# EAGLE board dsp_ice_rev2_release (EAGLE 7.6.0), part 1 of 2
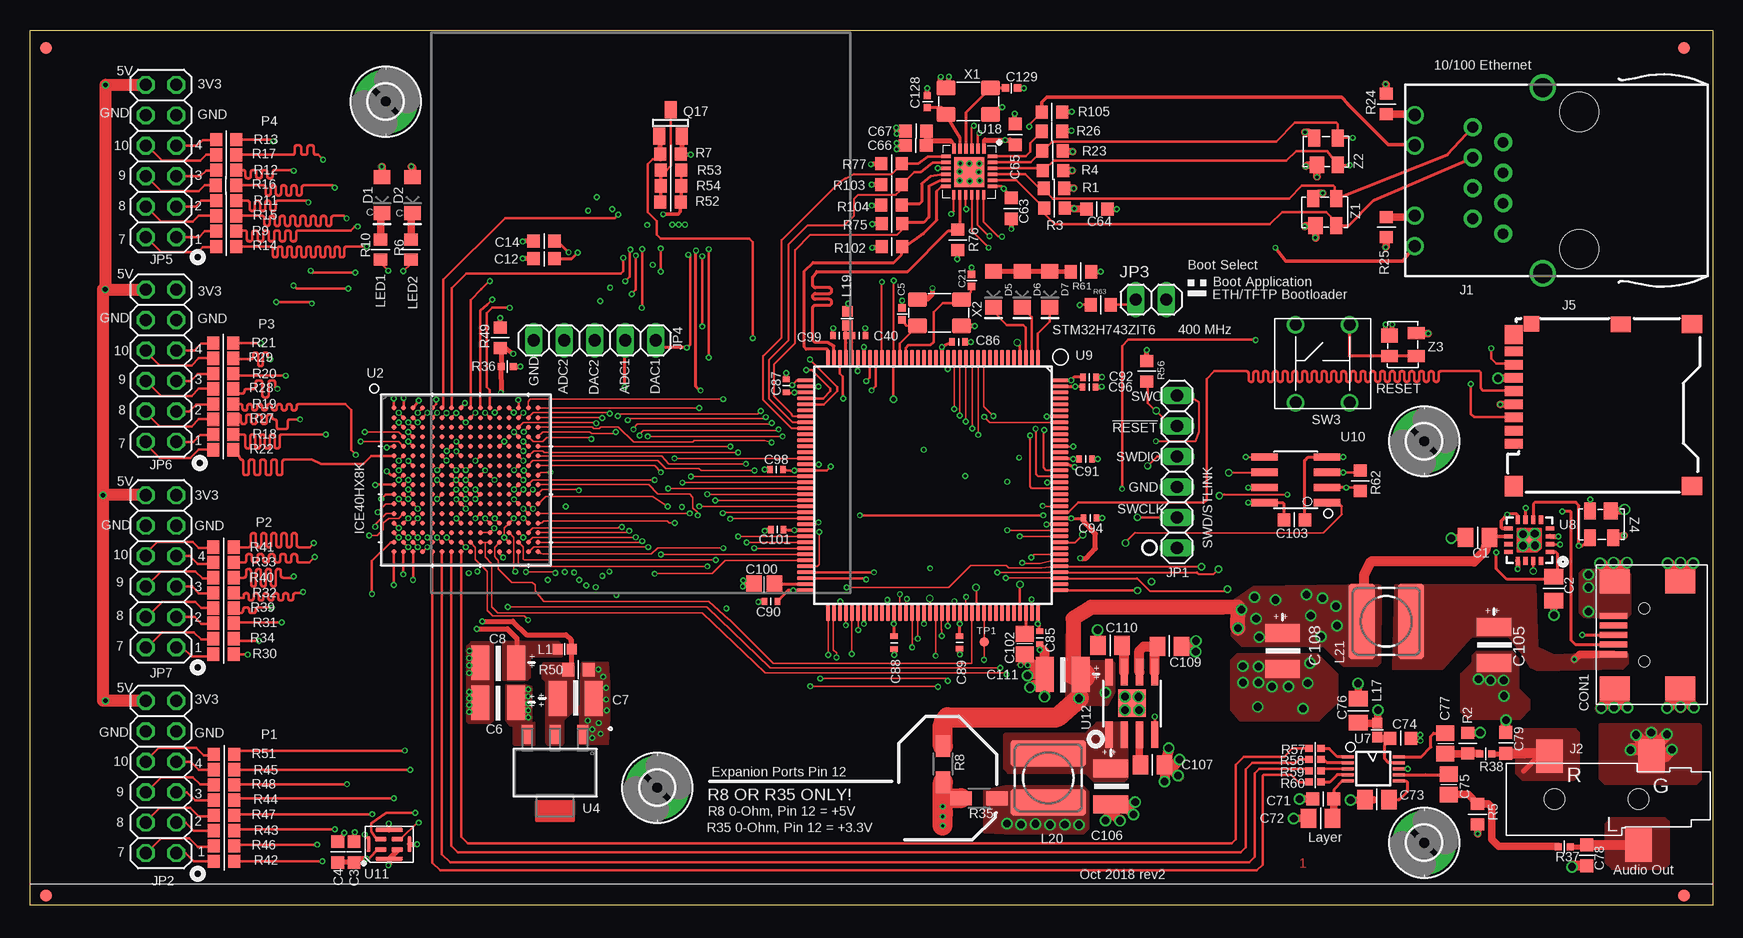
[diagram p8: board, top side]
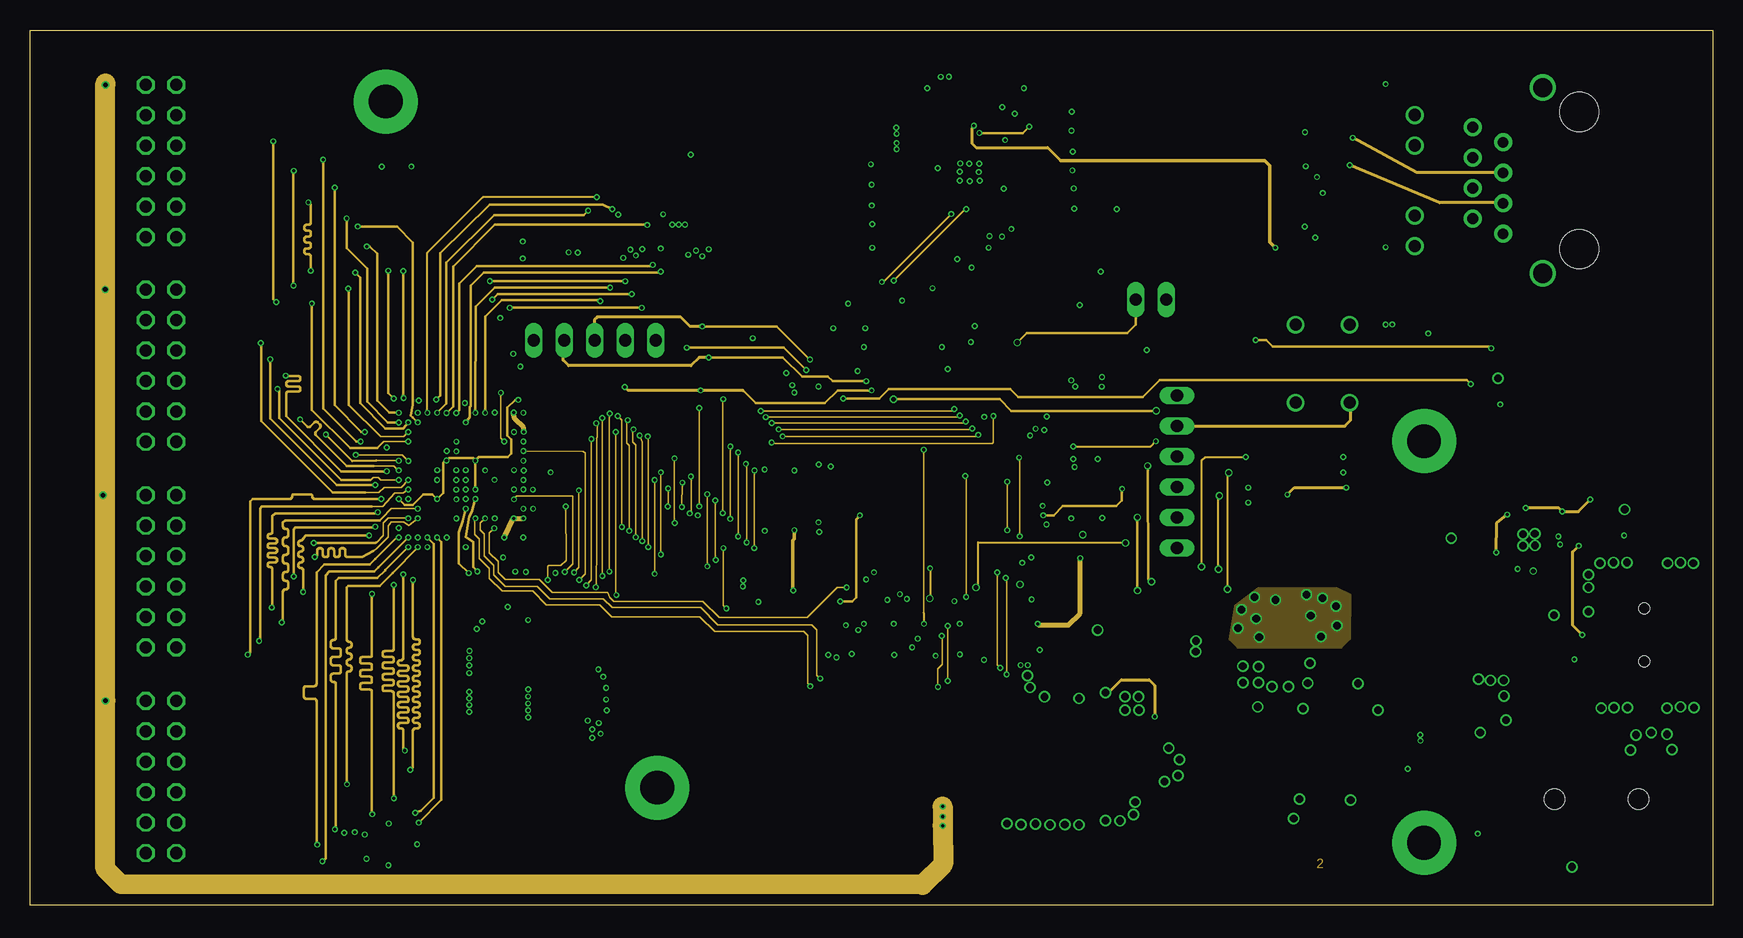
[diagram p9: board, inner layer Route2]
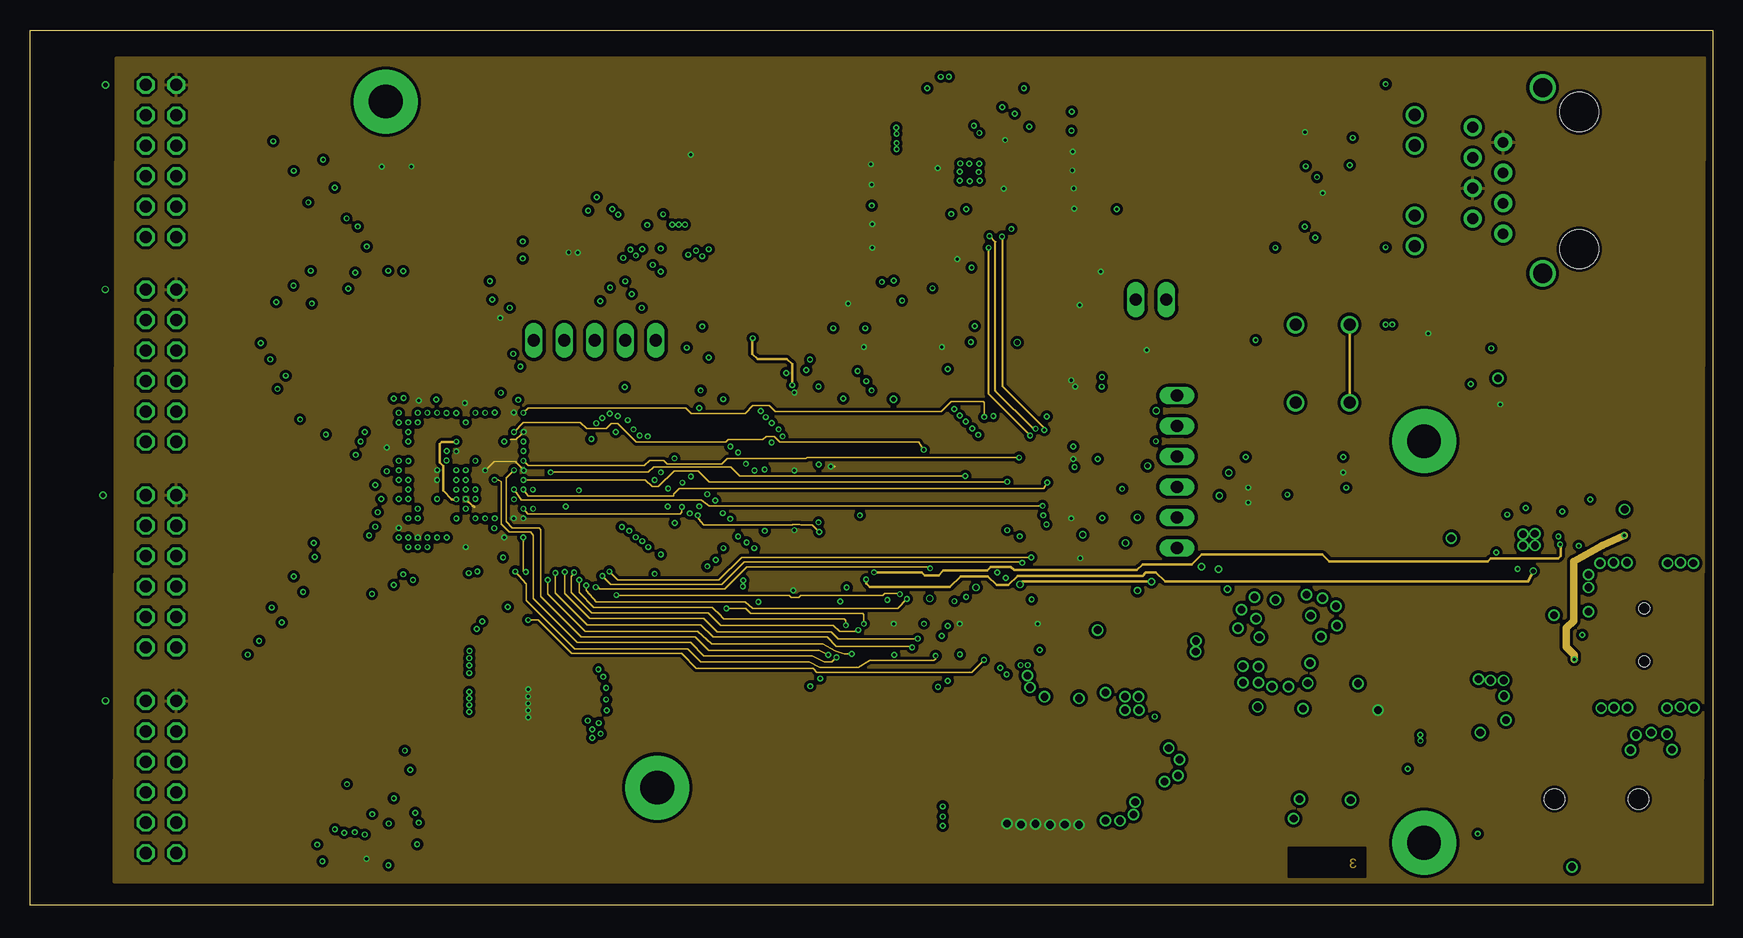
[diagram p10: board, inner layer Route3]
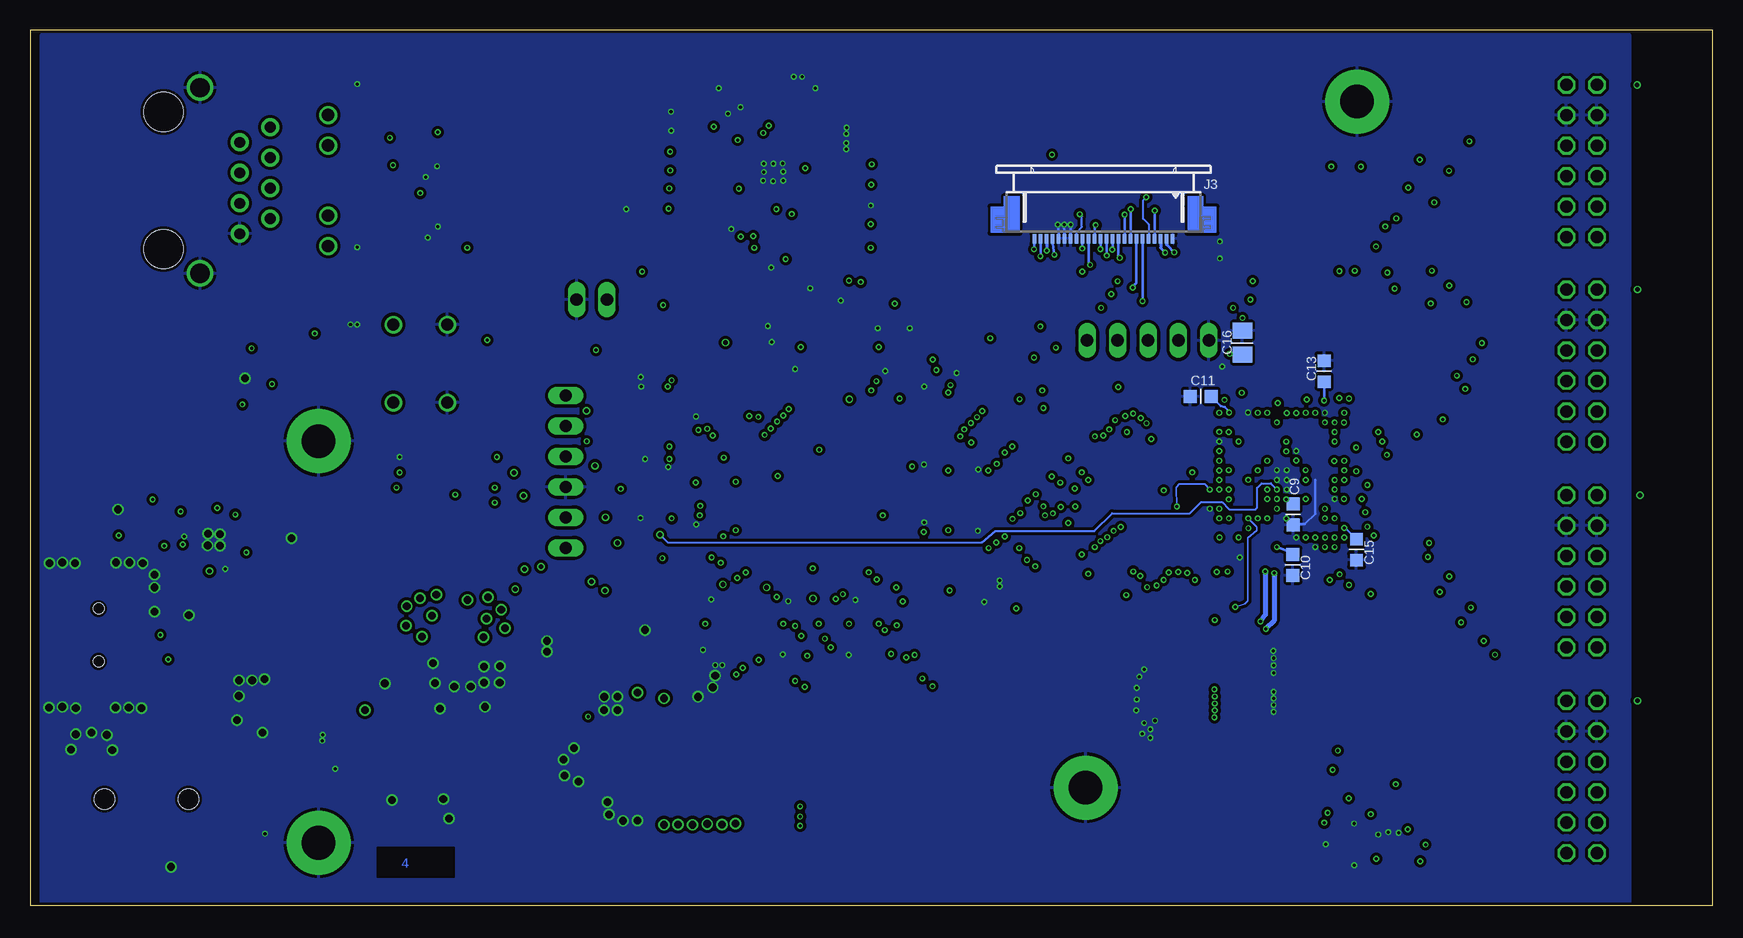
[diagram p11: board, bottom side, seen from below]

Size 140.23 x 73 mm. Coordinates in mm from the lower left corner, seen from the top.
Outline: 0,73 140.23,73 140.23,0 0,0 0,73
Copper layers (1+2+3+16): Top 0.035mm / dielectric 0.2mm / Route2 0.035mm / dielectric 0.15mm / Route3 0.035mm / dielectric 0.2mm / Bottom 0.035mm
Design rules "default *": minimum track width 5mil, minimum drill 10mil, track to track 5mil, track to pad 5mil, pad to pad 5mil, via to via 5mil, smd to smd 1mil, copper to edge 10mil, drill to drill 10mil, minimum pad ring 4.5mil, minimum via ring 4.5mil, stop-mask expansion 0mil, vias tented up to drill 25mil, thermal gap 10mil

## Footprints (pad centres in the part's own frame; a part is rotated, then mirrored left to right if it is on the bottom)
C0805 = smd 1.3 x 1.6: 1 -1,0; 2 1,0
C0603 = smd 1.05 x 1.08: 1 -0.875,0; 2 0.875,0
C0402 = smd 0.6 x 0.6: 1 -0.5,0; 2 0.501,0
1210K = smd 1.5 x 2.9: A -1.5,0; C 1.5,0
0402 = smd 0.457 x 0.61: 1 -0.524,0; 2 0.549,0
C0805' = smd 1.3 x 1.5: 1 -0.85,0; 2 0.85,0
1734035-2 = smd 2.3 x 0.5: 1 2.9,1.45; 2 2.9,0.65; 3 2.9,-0.15; 4 2.9,-0.95; 5 2.9,-1.75 | smd 2.5 x 2: 6 -2.65,-4.6; 7 -2.65,4.3; 8 2.8,-4.6; 9 2.8,4.3 | hole 0.9: 0.35,2.05; 0.35,-2.35
LED-1206 = smd 1.2 x 1.4: A -1.5,0; C 1.5,0
FIDUCIAL = smd 1.016 x 1.016: 1 0,0
2,8-PAD = drill 2.8 pad 5.334: B2,8 0,0
SI-50170 = drill 0.9 pad 1.5: 1 4.445,5.842; 2 3.175,3.302; 3 1.905,5.842; 4 0.635,3.302; 5 -0.635,5.842; 6 -1.905,3.302; 7 -3.175,5.842; 8 -4.445,3.302 | drill 1.016 pad 1.5: A1 -5.461,10.668; A2 2.921,10.668; C1 -2.921,10.668; C2 5.461,10.668 | drill 1.6 pad 2.2: S1 -7.747,0; S2 7.747,0 | hole 3.251: -5.715,-3.048; 5.715,-3.048
SJ-3523 = smd 2.2 x 2.8: G 8.1,3.6; L 7,-3.8; R -0.4,3.6 | hole 1.7: 0,0; 7,0
52745-2490 = smd 0.3 x 0.8: 1 -5.75,2.5; 2 -5.25,2.5; 3 -4.75,2.5; 4 -4.25,2.5; 5 -3.75,2.5; 6 -3.25,2.5; 7 -2.75,2.5; 8 -2.25,2.5; 9 -1.75,2.5; 10 -1.25,2.5; 11 -0.75,2.5; 12 -0.25,2.5; 13 0.25,2.5; 14 0.75,2.5; 15 1.25,2.5; 16 1.75,2.5; 17 2.25,2.5; 18 2.75,2.5; 19 3.25,2.5; 20 3.75,2.5; 21 4.25,2.5; 22 4.75,2.5; 23 5.25,2.5; 24 5.75,2.5
SD-502774-001 = smd 0.8 x 1.5: 1 3.26,-7.43; 2 2.16,-7.43; 3 1.06,-7.43; 4 -0.04,-7.43; 5 -1.14,-7.43; 6 -2.24,-7.43; 7 -3.34,-7.43; 8 -4.44,-7.43 | smd 1.29 x 1.7: DET -6.69,1.5 | smd 1.7 x 1.5: GND@1 6.8,-7.4 | smd 1.5 x 1.7: GND@2 6.78,7.44; GND@3 -6.72,7.45 | smd 1.6 x 1.5: GND@4 -5.85,-7.42 | smd 1.29 x 1.3: SW -6.76,-5.94
1X06 = drill 1.016 long: 1 -6.35,0; 2 -3.81,0; 3 -1.27,0; 4 1.27,0; 5 3.81,0; 6 6.35,0
2X06 = drill 1.016 octagon: 1 -6.35,-1.27; 2 -3.81,-1.27; 3 -1.27,-1.27; 4 1.27,-1.27; 5 3.81,-1.27; 6 6.35,-1.27; 7 -6.35,1.27; 8 -3.81,1.27; 9 -1.27,1.27; 10 1.27,1.27; 11 3.81,1.27; 12 6.35,1.27
1X02 = drill 1.016 long: 1 -1.27,0; 2 1.27,0
1X05 = drill 1.016 long: 1 -5.08,0; 2 -2.54,0; 3 0,0; 4 2.54,0; 5 5.08,0
0603 = smd 0.864 x 0.864: 1 -0.595,0; 2 0.573,0
POWER-CHOKE_WE-TPC = smd 6.3 x 2.2: 1 0,2.05; 2 0,-2.05
SOT23_BSS84_PACKAGE = smd 1 x 1.4: 1 -0.942,-1.116; 2 0.941,-1.116; 3 0,1.092
R0603 = smd 1 x 1.1: 1 -0.85,0; 2 0.85,0
R1206W = smd 1.8 x 1.2: 1 -1.499,0; 2 1.499,0
R0402 = smd 0.6 x 0.6: 1 -0.5,0; 2 0.5,0
TACTILE_6X6MM = drill 1: 1 0,0; 2 4.5,0; 3 4.5,6.5; 4 0,6.5
TP08R = smd 0.8 x 0.8: TP 0,0
CABGA256 = smd 0.406 x 0.406: A1 -6,6; A2 -5.2,6; A3 -4.4,6; A4 -3.6,6; A5 -2.8,6; A6 -2,6; A7 -1.2,6; A8 -0.4,6; A9 0.4,6; A10 1.2,6; A11 2,6; A12 2.8,6; A13 3.6,6; A14 4.4,6; A15 5.2,6; A16 6,6; B1 -6,5.2; B2 -5.2,5.2; B3 -4.4,5.2; B4 -3.6,5.2; B5 -2.8,5.2; B6 -2,5.2; B7 -1.2,5.2; B8 -0.4,5.2; B9 0.4,5.2; B10 1.2,5.2; B11 2,5.2; B12 2.8,5.2; B13 3.6,5.2; B14 4.4,5.2; B15 5.2,5.2; B16 6,5.2; C1 -6,4.4; C2 -5.2,4.4; C3 -4.4,4.4; C4 -3.6,4.4; C5 -2.8,4.4; C6 -2,4.4; C7 -1.2,4.4; C8 -0.4,4.4; C9 0.4,4.4; C10 1.2,4.4; C11 2,4.4; C12 2.8,4.4; C13 3.6,4.4; C14 4.4,4.4; C15 5.2,4.4; C16 6,4.4; D1 -6,3.6; D2 -5.2,3.6; D3 -4.4,3.6; D4 -3.6,3.6; D5 -2.8,3.6; D6 -2,3.6; D7 -1.2,3.6; D8 -0.4,3.6; D9 0.4,3.6; D10 1.2,3.6; D11 2,3.6; D12 2.8,3.6; D13 3.6,3.6; D14 4.4,3.6; D15 5.2,3.6; D16 6,3.6; E1 -6,2.8; E2 -5.2,2.8; E3 -4.4,2.8; E4 -3.6,2.8; E5 -2.8,2.8; E6 -2,2.8; E7 -1.2,2.8; E8 -0.4,2.8; E9 0.4,2.8; E10 1.2,2.8; E11 2,2.8; E12 2.8,2.8; E13 3.6,2.8; E14 4.4,2.8; E15 5.2,2.8; E16 6,2.8; F1 -6,2; F2 -5.2,2; F3 -4.4,2; F4 -3.6,2; F5 -2.8,2; F6 -2,2; F7 -1.2,2; F8 -0.4,2; F9 0.4,2; F10 1.2,2; F11 2,2; F12 2.8,2; F13 3.6,2; F14 4.4,2; F15 5.2,2; F16 6,2; G1 -6,1.2; G2 -5.2,1.2; G3 -4.4,1.2; G4 -3.6,1.2; G5 -2.8,1.2; G6 -2,1.2; G7 -1.2,1.2; G8 -0.4,1.2; G9 0.4,1.2; G10 1.2,1.2; G11 2,1.2; G12 2.8,1.2; G13 3.6,1.2; G14 4.4,1.2; G15 5.2,1.2; G16 6,1.2; H1 -6,0.4; H2 -5.2,0.4; H3 -4.4,0.4; H4 -3.6,0.4; H5 -2.8,0.4; H6 -2,0.4; H7 -1.2,0.4; H8 -0.4,0.4; H9 0.4,0.4; H10 1.2,0.4; H11 2,0.4; H12 2.8,0.4; H13 3.6,0.4; H14 4.4,0.4; H15 5.2,0.4; H16 6,0.4; J1 -6,-0.4; J2 -5.2,-0.4; J3 -4.4,-0.4; J4 -3.6,-0.4; J5 -2.8,-0.4; J6 -2,-0.4; J7 -1.2,-0.4; J8 -0.4,-0.4; J9 0.4,-0.4; J10 1.2,-0.4; J11 2,-0.4; J12 2.8,-0.4; J13 3.6,-0.4; J14 4.4,-0.4; J15 5.2,-0.4; J16 6,-0.4; K1 -6,-1.2; K2 -5.2,-1.2; K3 -4.4,-1.2; K4 -3.6,-1.2; K5 -2.8,-1.2; K6 -2,-1.2; K7 -1.2,-1.2; K8 -0.4,-1.2; K9 0.4,-1.2; K10 1.2,-1.2; K11 2,-1.2; K12 2.8,-1.2; K13 3.6,-1.2; K14 4.4,-1.2; K15 5.2,-1.2; K16 6,-1.2; L1 -6,-2; L2 -5.2,-2; L3 -4.4,-2; L4 -3.6,-2; L5 -2.8,-2; L6 -2,-2; L7 -1.2,-2; L8 -0.4,-2; L9 0.4,-2; L10 1.2,-2; L11 2,-2; L12 2.8,-2; L13 3.6,-2; L14 4.4,-2; L15 5.2,-2; L16 6,-2; M1 -6,-2.8; M2 -5.2,-2.8; M3 -4.4,-2.8; M4 -3.6,-2.8; M5 -2.8,-2.8; M6 -2,-2.8; M7 -1.2,-2.8; M8 -0.4,-2.8; M9 0.4,-2.8; M10 1.2,-2.8; M11 2,-2.8; M12 2.8,-2.8; M13 3.6,-2.8; M14 4.4,-2.8; M15 5.2,-2.8; M16 6,-2.8; N1 -6,-3.6; N2 -5.2,-3.6; N3 -4.4,-3.6; N4 -3.6,-3.6; N5 -2.8,-3.6; N6 -2,-3.6; N7 -1.2,-3.6; N8 -0.4,-3.6; N9 0.4,-3.6; N10 1.2,-3.6; N11 2,-3.6; N12 2.8,-3.6; N13 3.6,-3.6; N14 4.4,-3.6; N15 5.2,-3.6; N16 6,-3.6; P1 -6,-4.4; P2 -5.2,-4.4; P3 -4.4,-4.4; P4 -3.6,-4.4; P5 -2.8,-4.4; P6 -2,-4.4; P7 -1.2,-4.4; P8 -0.4,-4.4; P9 0.4,-4.4; P10 1.2,-4.4; P11 2,-4.4; P12 2.8,-4.4; P13 3.6,-4.4; P14 4.4,-4.4; P15 5.2,-4.4; P16 6,-4.4; R1 -6,-5.2; R2 -5.2,-5.2; R3 -4.4,-5.2; R4 -3.6,-5.2; R5 -2.8,-5.2; R6 -2,-5.2; R7 -1.2,-5.2; R8 -0.4,-5.2; R9 0.4,-5.2; R10 1.2,-5.2; R11 2,-5.2; R12 2.8,-5.2; R13 3.6,-5.2; R14 4.4,-5.2; R15 5.2,-5.2; R16 6,-5.2; T1 -6,-6; T2 -5.2,-6; T3 -4.4,-6; T4 -3.6,-6; T5 -2.8,-6; T6 -2,-6; T7 -1.2,-6; T8 -0.4,-6; T9 0.4,-6; T10 1.2,-6; T11 2,-6; T12 2.8,-6; T13 3.6,-6; T14 4.4,-6; T15 5.2,-6; T16 6,-6
SOT-223 = smd 0.914 x 1.6: 1 -2.3,-3.2; 2 0,-3.2; 3 2.3,-3.2
MSOP10 = smd 0.25 x 1: 1 -1,-2.113; 2 -0.5,-2.113; 3 0,-2.113; 4 0.5,-2.113; 5 1,-2.113; 6 1,2.113; 7 0.5,2.113; 8 0,2.113; 9 -0.5,2.113; 10 -1,2.113
QFN16 = smd 0.7 x 0.35: 1 -1.725,0.975; 2 -1.725,0.325; 3 -1.725,-0.325; 4 -1.725,-0.975; 9 1.725,-0.975; 10 1.725,-0.325; 11 1.725,0.325; 12 1.725,0.975 | smd 0.35 x 0.7: 5 -0.975,-1.725; 6 -0.325,-1.725; 7 0.325,-1.725; 8 0.975,-1.725; 13 0.975,1.725; 14 0.325,1.725; 15 -0.325,1.725; 16 -0.975,1.725 | smd 1 x 1: TAB 0,0
STM32F407_144 = smd 1.35 x 0.32: 1 -10.625,8.75; 2 -10.625,8.25; 3 -10.625,7.75; 4 -10.625,7.25; 5 -10.625,6.75; 6 -10.625,6.25; 7 -10.625,5.75; 8 -10.625,5.25; 9 -10.625,4.75; 10 -10.625,4.25; 11 -10.625,3.75; 12 -10.625,3.25; 13 -10.625,2.75; 14 -10.625,2.25; 15 -10.625,1.75; 16 -10.625,1.25; 17 -10.625,0.75; 18 -10.625,0.25; 19 -10.625,-0.25; 20 -10.625,-0.75; 21 -10.625,-1.25; 22 -10.625,-1.75; 23 -10.625,-2.25; 24 -10.625,-2.75; 25 -10.625,-3.25; 26 -10.625,-3.75; 27 -10.625,-4.25; 28 -10.625,-4.75; 29 -10.625,-5.25; 30 -10.625,-5.75; 31 -10.625,-6.25; 32 -10.625,-6.75; 33 -10.625,-7.25; 34 -10.625,-7.75; 35 -10.625,-8.25; 36 -10.625,-8.75; 73 10.625,-8.75; 74 10.625,-8.25; 75 10.625,-7.75; 76 10.625,-7.25; 77 10.625,-6.75; 78 10.625,-6.25; 79 10.625,-5.75; 80 10.625,-5.25; 81 10.625,-4.75; 82 10.625,-4.25; 83 10.625,-3.75; 84 10.625,-3.25; 85 10.625,-2.75; 86 10.625,-2.25; 87 10.625,-1.75; 88 10.625,-1.25; 89 10.625,-0.75; 90 10.625,-0.25; 91 10.625,0.25; 92 10.625,0.75; 93 10.625,1.25; 94 10.625,1.75; 95 10.625,2.25; 96 10.625,2.75; 97 10.625,3.25; 98 10.625,3.75; 99 10.625,4.25; 100 10.625,4.75; 101 10.625,5.25; 102 10.625,5.75; 103 10.625,6.25; 104 10.625,6.75; 105 10.625,7.25; 106 10.625,7.75; 107 10.625,8.25; 108 10.625,8.75 | smd 0.32 x 1.35: 37 -8.75,-10.625; 38 -8.25,-10.625; 39 -7.75,-10.625; 40 -7.25,-10.625; 41 -6.75,-10.625; 42 -6.25,-10.625; 43 -5.75,-10.625; 44 -5.25,-10.625; 45 -4.75,-10.625; 46 -4.25,-10.625; 47 -3.75,-10.625; 48 -3.25,-10.625; 49 -2.75,-10.625; 50 -2.25,-10.625; 51 -1.75,-10.625; 52 -1.25,-10.625; 53 -0.75,-10.625; 54 -0.25,-10.625; 55 0.25,-10.625; 56 0.75,-10.625; 57 1.25,-10.625; 58 1.75,-10.625; 59 2.25,-10.625; 60 2.75,-10.625; 61 3.25,-10.625; 62 3.75,-10.625; 63 4.25,-10.625; 64 4.75,-10.625; 65 5.25,-10.625; 66 5.75,-10.625; 67 6.25,-10.625; 68 6.75,-10.625; 69 7.25,-10.625; 70 7.75,-10.625; 71 8.25,-10.625; 72 8.75,-10.625; 109 8.75,10.625; 110 8.25,10.625; 111 7.75,10.625; 112 7.25,10.625; 113 6.75,10.625; 114 6.25,10.625; 115 5.75,10.625; 116 5.25,10.625; 117 4.75,10.625; 118 4.25,10.625; 119 3.75,10.625; 120 3.25,10.625; 121 2.75,10.625; 122 2.25,10.625; 123 1.75,10.625; 124 1.25,10.625; 125 0.75,10.625; 126 0.25,10.625; 127 -0.25,10.625; 128 -0.75,10.625; 129 -1.25,10.625; 130 -1.75,10.625; 131 -2.25,10.625; 132 -2.75,10.625; 133 -3.25,10.625; 134 -3.75,10.625; 135 -4.25,10.625; 136 -4.75,10.625; 137 -5.25,10.625; 138 -5.75,10.625; 139 -6.25,10.625; 140 -6.75,10.625; 141 -7.25,10.625; 142 -7.75,10.625; 143 -8.25,10.625; 144 -8.75,10.625
SO8 = smd 0.61 x 2.21: 1 -1.905,-2.616; 2 -0.635,-2.616; 3 0.635,-2.616; 4 1.905,-2.616; 5 1.905,2.616; 6 0.635,2.616; 7 -0.635,2.616; 8 -1.905,2.616
HCLGA5P-3X4X1MM = smd 0.95 x 0.4: 1 -0.675,-0.425; 2 0.675,-0.425; 3 0.675,0.425; 4 -0.675,0.425 | smd 2.3 x 0.35: 5 0,-1.2; 7 0,1.2 | smd 0.35 x 1.3: 6 1.7,0; 8 -1.7,0
SO8' = smd 0.6 x 2.2: 1 -1.905,-2.62; 2 -0.635,-2.62; 3 0.635,-2.62; 4 1.905,-2.62; 5 1.905,2.58; 6 0.635,2.58; 7 -0.635,2.58; 8 -1.905,2.58 | smd 2.29 x 2.29: GPAD 0,0
QFN-24 = smd 0.28 x 0.8: 1 -1.205,-1.836; 2 -0.705,-1.836; 3 -0.205,-1.836; 4 0.295,-1.836; 5 0.795,-1.836; 6 1.295,-1.836; 13 1.3,2.03; 14 0.8,2.03; 15 0.3,2.03; 16 -0.2,2.03; 17 -0.7,2.03; 18 -1.2,2.03 | smd 0.8 x 0.28: 7 1.94,-1.191; 8 1.94,-0.691; 9 1.94,-0.191; 10 1.94,0.309; 11 1.94,0.809; 12 1.94,1.309; 19 -1.929,1.3; 20 -1.929,0.8; 21 -1.929,0.3; 22 -1.929,-0.2; 23 -1.929,-0.7; 24 -1.929,-1.2 | smd 2.5 x 2.5: GP 0,0.1
ECS-250-20-30B-DU_CRYSTAL = smd 1.6 x 1.25: 1 -1.9,-1.1; 3 1.8,1.1; GND@1 -1.9,1.1; GND@2 1.8,-1.1
SR2.8.TCT_1PRIMARY = smd 1.397 x 1.194: 1 -1.168,0.813 | smd 1.397 x 0.991: 2 -1.168,-0.914; 3 1.067,-0.914; 4 1.067,1.016

## Placement (x,y rotation side)
C1  10uF  [C0805]  120.62,30.68 180 top
C2  10uF  [C0805]  126.97,26.42 270 top
C3  0.1uF  [C0603]  27,4.47 90 top
C4  1uF  [C0603]  25.65,4.47 90 top
C5  10pF  [C0402]  72.67,49.33 270 top
C6  22uF  [1210K]  39,16.92 180 top
C7  22uF  [1210K]  45.48,17.27 0 top
C8  22uF  [1210K]  39.01,20.24 180 top
C9  0.1uF  [C0603]  34.98,32.6 270 bottom
C10  1uF  [C0603]  35,28.4 270 bottom
C11  1uF  [C0603]  42.67,42.44 180 bottom
C12  0.1uF  [C0603]  42.85,53.92 180 top
C13  1uF  [C0603]  32.38,44.55 90 bottom
C14  0.1uF  [C0603]  42.85,55.4 180 top
C15  1uF  [C0603]  29.69,29.67 270 bottom
C16  2.2uF  [C0805]  39.19,46.94 90 bottom
C21  10pF  [C0402]  78.46,52.12 270 top
C40  0.1uF  [0402]  69.06,47.52 0 top
C63  0.1uF  [C0603]  81.76,58.12 270 top
C64  0.1uF  [C0603]  88.9,58.06 0 top
C65  0.1uF  [C0603]  82.09,64.29 90 top
C66  1uF  [C0603]  73.81,63.37 180 top
C67  0.1uF  [C0603]  73.84,64.57 180 top
C71  0.1uF  [C0603]  107.77,8.89 180 top
C72  10uF  [C0805]  107.54,7.26 180 top
C73  10uF  [C0805]  112.24,8.84 0 top
C74  0.1uF  [C0603]  114.22,13.94 0 top
C75  2.2uF  [C0805']  118.21,10.11 90 top
C76  2.2uF  [C0805]  110.69,16.26 90 top
C77  2.2uF  [C0805']  117.96,13.51 90 top
C78  8200pF  [C0603]  129.72,4.19 270 top
C79  8200pF  [C0603]  122.99,13.56 90 top
C85  0.1uF  [0402]  84.15,22.35 270 top
C86  0.1uF  [0402]  77.37,46.99 0 top
C87  0.1uF  [0402]  63.02,43.33 90 top
C88  0.1uF  [0402]  72.01,21.92 270 top
C89  0.1uF  [0402]  77.47,21.95 270 top
C90  0.1uF  [0402]  61.77,25.35 180 top
C91  0.1uF  [0402]  87.96,37.24 0 top
C92  0.1uF  [0402]  88.27,44.04 0 top
C94  0.1uF  [0402]  88.32,32.31 0 top
C96  0.1uF  [0402]  88.24,43.23 0 top
C98  0.1uF  [0402]  62.23,36.35 180 top
C99  0.1uF  [0402]  67.46,47.52 180 top
C100  2.2uF  [C0805']  61.19,26.77 180 top
C101  0.1uF  [0402]  62.28,31.34 180 top
C102  2.2uF  [C0805']  82.91,21.79 270 top
C103  0.1uF  [C0603]  105.36,32.16 0 top
C105  470uF_tant  [1210K]  122,21.72 270 top
C106  470uF_tant  [1210K]  90.07,9.93 270 top
C107  2.2uF  [C0805]  93.55,11.73 0 top
C108  470uF_tant  [1210K]  104.37,21.23 270 top
C109  2.2uF  [C0805]  94.97,21.62 0 top
C110  2.2uF  [C0805]  89.99,21.69 180 top
C111  22uF  [1210K]  86.06,19.28 180 top
C128  10pF  [C0402]  74.78,67.03 270 top
C129  10pF  [C0402]  81.79,68.17 180 top
CON1  1734035-2  [1734035-2]  134.87,22.4 180 top
D1  [LED-1206]  29.34,59.23 270 top
D2  [LED-1206]  31.88,59.23 270 top
D5  [LED-1206]  80.29,51.36 270 top
D6  [LED-1206]  82.68,51.36 270 top
D7  [LED-1206]  84.99,51.36 270 top
FID1  FIDUCIALSMD  [FIDUCIAL]  137.82,0.84 0 top
FID2  FIDUCIALSMD  [FIDUCIAL]  1.35,71.5 0 top
FID3  FIDUCIALSMD  [FIDUCIAL]  137.82,71.5 0 top
FID4  FIDUCIALSMD  [FIDUCIAL]  1.35,0.84 0 top
H1  MOUNT-PAD-ROUND2.8  [2,8-PAD]  29.64,67.03 0 top
H2  MOUNT-PAD-ROUND2.8  [2,8-PAD]  52.27,9.83 0 top
H3  MOUNT-PAD-ROUND2.8  [2,8-PAD]  116.18,38.71 0 top
H4  MOUNT-PAD-ROUND2.8  [2,8-PAD]  116.18,5.23 0 top
J1  SI-50170  [SI-50170]  126.06,60.45 90 top
J2  SJ-3523  [SJ-3523]  127.03,8.86 0 top
J3  0524352471  [52745-2490]  50.77,58.09 180 bottom
J5  5027740891  [SD-502774-001]  131.06,41.76 270 top
JP1  [1X06]  95.58,36.17 90 top
JP2  [2X06]  10.92,10.72 90 top
JP3  [1X02]  93.42,50.52 0 top
JP4  [1X05]  47.07,47.12 180 top
JP5  [2X06]  10.92,62.08 90 top
JP6  [2X06]  10.92,45.01 90 top
JP7  [2X06]  10.92,27.86 90 top
L1  [0603]  44.55,21.36 180 top
L17  [0603]  112.27,14.63 90 top
L19  [0603]  68.13,48.94 270 top
L20  22uH_744053220  [POWER-CHOKE_WE-TPC]  84.86,10.64 0 top
L21  22uH_744053220  [POWER-CHOKE_WE-TPC]  113.03,23.7 90 top
Q17  BSS84  [SOT23_BSS84_PACKAGE]  53.39,65.25 0 top
R1  49.9  [R0603]  85.34,59.79 180 top
R2  12.1k  [R0603]  119.81,13.54 90 top
R3  49.9  [R0603]  85.37,58.14 180 top
R4  49.9  [R0603]  85.24,61.26 180 top
R5  12.1k  [R0603]  120.62,7.62 270 top
R6  270  [R0603]  31.75,54.69 270 top
R7  12.1k  [R0603]  53.39,62.64 0 top
R8  zero_ohm  [R1206W]  76.07,11.79 270 top
R9  10  [R0603]  16.36,56.24 180 top
R10  270  [R0603]  29.21,54.69 270 top
R11  10  [R0603]  16.36,58.78 180 top
R12  10  [R0603]  16.36,61.32 180 top
R13  10  [R0603]  16.36,63.86 180 top
R14  10  [R0603]  16.36,54.94 0 top
R15  10  [R0603]  16.36,57.51 0 top
R16  10  [R0603]  16.33,60.05 0 top
R17  10  [R0603]  16.36,62.59 0 top
R18  10  [R0603]  16.1,39.27 180 top
R19  10  [R0603]  16.1,41.81 180 top
R20  10  [R0603]  16.1,44.35 180 top
R21  10  [R0603]  16.1,46.89 180 top
R22  10  [R0603]  16.1,38 0 top
R23  49.9  [R0603]  85.22,62.92 180 top
R24  270  [R0603]  113.03,66.83 90 top
R25  270  [R0603]  113.03,56.57 270 top
R26  12.1k  [R0603]  85.17,64.54 0 top
R27  10  [R0603]  16.1,40.54 0 top
R28  10  [R0603]  16.1,43.08 0 top
R29  10  [R0603]  16.1,45.62 0 top
R30  10  [R0603]  16.13,20.95 180 top
R31  10  [R0603]  16.13,23.55 180 top
R32  10  [R0603]  16.13,26.06 180 top
R33  10  [R0603]  16.13,28.6 180 top
R34  10  [R0603]  16.13,22.25 0 top
R35  DNP  [R1206W]  79.1,8.94 180 top
R36  470  [R0402]  39.78,44.93 0 top
R37  470  [R0402]  127.86,4.9 180 top
R38  470  [R0402]  121.31,12.65 180 top
R39  10  [R0603]  16.13,24.79 0 top
R40  10  [R0603]  16.13,27.33 0 top
R41  10  [R0603]  16.13,29.87 0 top
R42  10  [R0603]  16.18,3.68 180 top
R43  10  [R0603]  16.18,6.25 180 top
R44  10  [R0603]  16.18,8.79 180 top
R45  10  [R0603]  16.18,11.33 180 top
R46  10  [R0603]  16.18,4.98 0 top
R47  10  [R0603]  16.18,7.52 0 top
R48  10  [R0603]  16.18,10.06 0 top
R49  49.9  [R0603]  39.19,47.35 90 top
R50  120  [R0603]  45.71,19.66 180 top
R51  10  [R0603]  16.18,12.6 0 top
R52  270  [R0603]  53.39,58.65 180 top
R53  270  [R0603]  53.42,61.32 180 top
R54  270  [R0603]  53.42,59.99 180 top
R56  12.1k  [R0603]  93.07,44.55 270 top
R57  470  [R0402]  107.09,13.11 180 top
R58  470  [R0402]  107.09,12.19 180 top
R59  470  [R0402]  107.09,11.23 180 top
R60  470  [R0402]  107.09,10.31 180 top
R61  270  [R0603]  87.58,52.83 180 top
R62  DNP  [R0603]  110.85,35.41 270 top
R63  12.1k  [R0603]  89.23,50.09 0 top
R75  12.1k  [R0603]  71.83,56.85 0 top
R76  12.1k  [R0603]  77.32,55.5 90 top
R77  12.1k  [R0603]  71.81,61.85 0 top
R102  12.1k  [R0603]  71.83,54.94 0 top
R103  12.1k  [R0603]  71.81,60.1 0 top
R104  12.1k  [R0603]  71.81,58.39 180 top
R105  12.1k  [R0603]  85.17,66.14 0 top
SW3  HOKURIKU_KSM06_6X6MM_SWITCH1  [TACTILE_6X6MM]  105.46,41.94 0 top
TP1  PTR1TP08R  [TP08R]  79.5,21.97 0 top
U2  ICE40HX8K-CT256  [CABGA256]  36.32,35.48 0 top
U4  LD1117S12TR  [SOT-223]  43.75,11.07 180 top
U7  CS4344  [MSOP10]  111.94,11.4 270 top
U8  FT230XQ  [QFN16]  124.94,30.45 180 top
U9  STM32H743ZIT6  [STM32F407_144]  75.23,35.03 270 top
U10  S25FL116K0XMFI041  [SO8]  105.48,35.49 90 top
U11  MP34DT05TR-A  [HCLGA5P-3X4X1MM]  29.92,5.11 0 top
U12  ADP7156ARDZ-3.3-R7  [SO8']  91.82,16.87 0 top
U18  LAN8742  [QFN-24]  78.28,61.26 180 top
X1  25MHz  [ECS-250-20-30B-DU_CRYSTAL]  78.23,67.06 0 top
X2  8MHZ  [ECS-250-20-30B-DU_CRYSTAL]  75.74,49.43 180 top
Z1  CD143A-SR05  [SR2.8.TCT_1PRIMARY]  107.95,57.86 90 top
Z2  CD143A-SR05  [SR2.8.TCT_1PRIMARY]  108.05,62.92 90 top
Z3  CD143A-SR05  [SR2.8.TCT_1PRIMARY]  114.45,46.71 0 top
Z4  CD143A-SR05  [SR2.8.TCT_1PRIMARY]  130.91,31.72 270 top

## Tracks (layer width: path | path; a pad name or v marks a point on that pad's centre or on a via)
3V3  (via drill 0.25, 0.25 pad 0.25, 0.25 pad 0.41, 0.64)
  Top 0.127: U2.N13 39.52,31.47 v39.52,30.68
  Top 0.203: v33.93,36.3 v33.94,36.3 U2.G6 | v35.53,37.87 U2.F8 | U2.H10 | U2.H10 v37.92,36.28 | U2.J6 | U2.J6 v33.92,35.48 | v29.73,38.19 30.09,38.29 U2.E1 | U2.A3 v32.4,42.1 | U2.A8 v36.25,41.9 | U2.A13 v40.31,41.1 | U2.C15 | U2.C15 v41.13,39.5 | v41.13,36.27 41.12,36.28 U2.H15 | U2.N15 41.16,32.3 v41.12,32.28 41.08,32.25 | v40.32,32.28 | v40.32,32.28 U2.N13 | v39.52,30.68 U2.R13 | U2.R8 | U2.R8 v36.32,29.88 | U2.P3 v32.31,30.7 | U2.N1 v30.72,31.48 | 64.47,36.28 66.4,36.28 v66.73,36.6 | v63.7,42.78 63.55,42.77 63.4,42.75 62.99,42.77 C87.1 | U2.K8 | U2.K8 v36.32,33.88 | v109.44,36.11 110.69,36.11 R62.1 | R63.1 87.5,50.09 v87.48,50.06 | U18.19 80.95,59.97 v81.15,59.77 81.76,59.16 | U18.9 75.7,61.46 v75.64,61.47
  Top 0.254: U9.143 86.77,43.28 v87.1,43.28 87.61,43.33 C96.1 | U9.144 86.77,43.78 v86.77,43.79 87.02,44.04 C92.1 | U9.121 v86.77,32.28 87.77,32.28 C94.1 | U9.131 86.77,37.28 v86.94,37.24 | U9.108 v83.97,23.5 84.12,23.34 C85.1 | U9.95 77.47,24.4 v77.47,23.5 C89.1 | U9.84 v71.98,23.5 72.01,23.47 C88.1 | U9.72 v63.6,26.28 | v63.6,26.28 63.6,26.26 | U9.62 63.7,31.28 | 63.7,31.28 v63.7,31.29 | U9.52 64.47,36.28 63.83,36.28 63.83,36.22 63.7,36.22 v63.7,36.27 63.7,36.25 C98.1 | U9.39 v63.7,42.78 v63.7,42.77 | U9.30 69.49,45.65 v69.49,46.56 | U9.17 76,45.65 v76,46.56 76.05,46.61 C86.1 | 63.7,31.28 63.19,31.28 C101.1 | v63.6,26.28 63.16,26.28 C90.1 | C91.1 v86.94,37.24 | 86.79,37.24 v86.94,37.24 | L19.1 v68.17,50.19 | v101.51,33.59 102.85,33.59 U10.8 102.87,33.59 104.41,33.59 104.49,33.51 C103.1 | U10.7 102.84,34.84 v101.51,34.84 | U10.3 108.11,36.11 v109.44,36.11 | R76.1 77.27,54.6 | R77.1 70.91,61.8 | R75.1 70.96,56.82 | R102.1 70.88,54.84 | U18.1 79.48,63.24 79.48,63.8 79.6,63.83 | 82.05,63.41 C65.1 | U18.19 | 81.76,59.16 C63.1 | R3.1 86.21,58.15 | 86.21,59.92 86.19,59.91 R1.1 86.09,59.89 | 86.44,61.34 R4.1 | R23.1 86.09,62.89 | U11.1 28.99,4.68 28.22,3.91 27.32,3.91 27.15,3.74 C3.1 | C14.1 43.94,55.4 v44.88,54.46 | C12.1 45.14,53.92 v45.64,54.43
  Top 0.406: R56.1 v93.07,46.3 | R61.1 v89.23,52.86 | v87.53,28.96 88.01,28.96 88.77,29.77 88.77,30.99 87.83,32.08 87.81,32.28 C94.1 | 77.27,54.6 v77.27,53.9 | 70.91,61.8 v70.08,61.8 | R103.1 v70.13,60.1 | 70.96,56.82 v70.18,56.82 | 70.88,54.84 v70.18,54.84 | 79.6,63.83 v81.25,63.83 81.69,63.83 82.05,63.41 | C64.1 88.07,58.06 | R49.2 v39.19,49 | 25.45,3.45 C4.1 C3.1 | v28.04,3.89 27.29,3.89 27.15,3.74 | Q17.2 54.33,62.65 R7.2 v55.07,62.61
  Top 0.61: C76.1 110.75,15.2 L17.2 112.32,15.25 v112.32,16.28 | D2.A 31.88,61.53 v31.79,61.62 | D1.A 29.34,61.6 v29.32,61.61 | v87.02,58.12 R3.1 C64.1 | 86.21,59.92 v86.97,59.79 | v86.87,61.29 R4.1 | v86.89,62.87 R23.1 | Z2.4 106.53,64.49 v106.25,64.49 | Z1.4 107.42,59.41 v107.72,59.41 | Z3.4 115.54,47.7 v116.51,47.7 | J5.4 v122.53,41.78
  Route2 0.152: 40.28,41.1 v40.31,41.1
  Route2 0.305: v63.7,31.29 63.7,30.56 63.58,30.43 63.58,26.3 v63.6,26.28
  Route2 0.406: v41.13,39.5 41.13,39.84 40.41,40.56 40.28,41.1 | v39.52,30.68 40.31,32.33 | v40.32,32.28 v41.12,32.28 | 84.07,23.39 86.54,23.39 87.5,24.36 87.5,28.93 v87.53,28.96
  Route3 0.127: v41.13,36.27 41.13,36.31 40.44,37.01 38.68,37.01 38.58,36.91 38.54,36.91 v37.92,36.28 | v41.13,39.5 41.13,39.48 40.92,39.27 | 40.03,38.84 40.49,38.84 40.92,39.27 | 40.95,39.27 40.92,39.27
  Route3 0.203: v66.73,36.6 67,36.6 | v36.32,33.88 36.32,33.86 36.88,33.3 36.96,33.3 37.01,33.25
  Bottom 0.203: v30.72,31.48 30.63,31.48 C15.1 | v40.31,41.1 40.31,41.2 40.69,41.58 41.02,41.66 C11.1 | v32.4,42.1 32.4,43.66 C13.1 | v36.32,29.88 35.69,29.63 C10.1
  Bottom 0.254: 44.88,54.43 v44.88,54.46 45.52,55.1 J3.2 | J3.3 46.02,54.81 v45.64,54.43
  other vias: 87.4,6.73 86.23,6.76 85.01,6.73 83.79,6.81 82.58,6.76 81.43,6.83 41.53,18.01 41.5,17.42 41.5,16.84 41.5,16.28 41.53,15.7
  pour Top (no thermals): 88.14,9.52 88.14,6.4 87.76,6.02 81.23,6.02 79.55,6.12 79.55,9.58 81.28,9.93 87.73,9.93
  pour Route3 (isolate 0.254): 7.19,70.69 139.52,70.69 139.37,1.93 7.04,1.93
  pour Top (no thermals): 40.31,13.49 40.31,15.04 40.46,15.19 42.04,15.24 42.04,13.39 40.41,13.39
  pour Top (no thermals): 40.28,15.04 40.01,15.04 39.7,15.47 39.7,18.34 41.17,18.39 41.78,18.24 41.78,15.34 41,15.01
3V_ANALOG
  Top 0.254: U9.32 68.48,46.97 C40.1 68.4,47.93 L19.2 67.99,48.22 C99.1 67.98,46.92 U9.33
20MHZ_REF
  Top 0.203: U9.23 72.98,46.49 73.2,46.71 75.03,46.71 75.31,46.99 75.31,49.48 76.05,50.22 77.33,50.22 X2.1 77.78,50.53 78.38,51.13 78.46,51.57 C21.2
!RESET  (via drill 0.25, 0.38)
  Top 0.152: U9.25 v71.98,52.1 | v78.03,58.06 77.98,58.14 U18.15
  Top 0.203: JP1.5 95.12,39.98 v93.85,41.25 93.8,41.25 93.14,41.91 93.14,43.63 R56.2 | v71.96,42.21 71.96,45.63 U9.25
  Top 0.254: SW3.3 109.96,45.8 Z3.2 Z3.3
  Route2 0.152: v71.98,52.1 77.95,58.06 v78.03,58.06
  Route2 0.203: v93.85,41.25 81.79,41.25 80.82,42.21 v71.96,42.21
  Route2 0.254: JP1.5 109.57,39.98 110.06,40.46 110.06,41.94 | 110.06,41.94 110.06,41.97 109.96,42.06 | SW3.2 110.06,41.94
  Route3 0.203: SW3.2 SW3.3
!RUN_BOOTL  (via drill 0.38)
  Top 0.203: R63.2 91.72,50.09 JP3.1 | U9.4 82.48,46.73 v82.27,46.94
  Route2 0.203: v82.27,46.94 83.06,47.73 91.44,47.73 92.15,48.44 JP3.1
+5V  (via drill 0.25, 0.64)
  Top 0.203: 87.69,19.15 87.69,17.56 v87.4,17.27
  Top 0.254: v93.73,15.75 U12.4 | 111.07,24.66 110.92,24.51 110.92,23.76 L21.1
  Top 0.305: U8.10 121.72,30.78 C1.1
  Top 0.61: 121.67,30.89 121.62,30.84 121.62,30.69 C1.1
  Top 0.813: 111.1,23.83 111.12,23.8 111.12,23.65 111.15,23.67 111.15,27.56 111.73,28.68 120.34,28.68 121.26,29.59 121.49,30.39 121.72,30.78
  Top 1.27: v100.66,23.14 100.69,24.89 99.36,24.87 88.43,24.87 86.92,23.93 86.92,19.56
  Top 1.676: R8.1 76.07,15.09 76.45,15.7 85.6,15.7 v87.4,17.27
  Top 2.184: 86.92,19.56 87.69,19.15
  Route2 0.254: v89.61,17.75 89.89,17.75 90.96,18.82 93.27,18.82 93.73,18.34 v93.73,15.75
  other vias: 106.38,25.91 107.72,25.63 108.84,24.97 106.73,24.18 102.06,25.7 102.44,22.38 103.78,25.48 107.57,22.43 100.97,24.66 102.18,23.93 108.92,23.32
  pour Top (no thermals): 102.01,26.57 112.4,26.72 112.52,26.52 112.5,20.24 112.24,19.99 109.5,19.99 107.82,21.67 101.02,21.67 100.2,22.48 100.41,25.43
  pour Top (no thermals): 90.32,20.22 90.32,17.83 89.71,16.71 86.36,16.69 86.41,17.58 86.41,22.63 87.45,22.63 87.43,20.95 87.5,20.37 90.2,20.35
  pour Route2 (isolate 0.254, no thermals): 100.43,24.99 102.34,26.44 108.89,26.44 110.03,25.91 109.98,22.22 109.27,21.51 100.63,21.51 99.97,22.17
ADDR0  (via drill 0.25)
  Top 0.127: U2.C16 42.34,39.9 46.84,39.9 46.99,39.75 47.42,39.75 47.57,39.9 49.02,39.9 50.29,38.63 55.22,38.63 55.35,38.76 61.24,38.76 v61.8,38.61 | v80.29,40.82 79.48,41.62 U9.10
  Route2 0.127: v61.8,38.61 62.08,38.51 80.19,38.51 80.29,38.61 v80.29,40.82
ADDR1  (via drill 0.25)
  Top 0.127: U2.T15 41.57,29.48 41.96,29.88 v51.51,29.88 | v51.49,39.12 v62.71,39.12 | v79.02,39.24 79.02,45.03 78.92,45.14 78.92,45.58 U9.11
  Route2 0.127: v51.51,29.88 51.51,39.09 v51.49,39.12 | v62.71,39.12 78.89,39.12 v79.02,39.24
ADDR2  (via drill 0.25)
  Top 0.127: U2.R16 42.32,30.25 50.91,30.26 v51.03,30.38 | v50.8,39.19 50.8,39.32 51.11,39.62 62.31,39.62 v62.38,39.7 | v78.51,39.78 78.51,45.63 U9.12
  Route2 0.127: v51.03,30.38 51.03,38.66 v50.8,39.19 | v62.38,39.7 78.44,39.7 v78.51,39.78
ADDR3  (via drill 0.25)
  Top 0.127: U2.R15 41.52,30.3 41.91,30.68 50.44,30.68 v50.47,30.71 | v50.29,39.7 50.29,39.83 50.6,40.13 61.72,40.13 v61.82,40.23 | v77.98,40.36 U9.13
  Route2 0.127: v50.47,30.71 50.47,38.38 50.22,38.63 50.22,39.62 v50.29,39.7 | v61.82,40.23 77.85,40.23 v77.98,40.36
ADDR4  (via drill 0.25)
  Top 0.127: U2.P16 49.78,31.08 v49.94,31.24 | v49.81,40.46 49.96,40.61 61.21,40.61 v61.32,40.72 | v77.47,40.84 77.47,45.64 U9.14
  Route2 0.127: v49.94,31.24 49.94,38.35 49.73,38.56 49.73,40.39 v49.81,40.46 | v61.32,40.72 77.34,40.72 v77.47,40.84
ADDR5  (via drill 0.25)
  Top 0.127: U2.P15 41.91,31.48 49.02,31.48 49.12,31.57 v49.33,31.57 | v48.97,40.82 48.97,40.89 49.07,41 60.66,41 v60.88,41.22 | v77.01,41.4 77.01,45.62 U9.15
  Route2 0.127: v49.33,31.57 49.33,40.46 v48.97,40.82 | v60.88,41.22 76.83,41.22 v77.01,41.4
ADDR6  (via drill 0.25)
  Top 0.127: U9.50 53.72,37.28 v53.71,37.29 | v53.72,31.89 53.28,31.89 53.09,32.08 42.82,32.08 42.63,31.89 U2.N16
  Route2 0.127: v53.71,37.29 53.71,31.9 v53.72,31.89
ADDR7  (via drill 0.25)
  Top 0.127: U9.53 55.08,35.78 v55.08,35.76 | v54.99,32.7 42.32,32.7 U2.M16
  Route2 0.127: v55.08,35.76 55.09,35.76 55.09,32.77 55.03,32.7 v54.99,32.7
ADDR8  (via drill 0.25)
  Top 0.127: U9.54 54.37,35.28 v54.37,35.26 | v41.12,33.08 41.13,33.07 U2.M15
  Route2 0.127: v54.37,35.26 54.36,35.26 v54.33,33.22
  Route3 0.127: v54.33,33.22 54.33,32.83 54.2,32.64 41.49,32.64 v41.12,33.08
ADDR9  (via drill 0.25)
  Top 0.127: U9.55 v53.18,34.78 v53.17,34.77 | v53.14,33.26 52.83,33.48 51.89,34.09 42.98,34.09 42.35,33.46 42.34,33.46 U2.L16
  Route2 0.127: v53.17,34.77 53.17,33.5 v53.14,33.26
ADDR10  (via drill 0.25)
  Top 0.127: U9.56 56.44,34.28 v56.43,34.29 | v56.45,28.28 40.84,28.28 40.69,28.44 40.69,29.45 U2.T14
  Route2 0.127: v56.43,34.29 56.43,28.31 v56.45,28.28
ADDR11  (via drill 0.25)
  Top 0.127: U9.57 v57.11,33.78 v57.1,33.78 | v57.15,28.8 41.19,28.8 41.12,28.87 41.12,29.88 U2.R14
  Route2 0.127: v57.1,33.78 57.1,30.28 57.11,30.26 57.11,28.84 v57.15,28.8
ADDR12  (via drill 0.25)
  Top 0.127: 40.66,31.08 U2.P14 v41.11,30.7 | v43.79,27.74 43.66,27.81 v41.33,27.81 | v73.51,21.51 73.51,24.38 U9.87
  Route3 0.127: v43.79,27.74 43.79,26.06 46.46,23.39 55.91,23.39 56.92,22.38 66.42,22.38 67.18,21.62 73.41,21.62 v73.51,21.51 | v41.11,30.7 41.12,27.86 v41.33,27.81
ADDR13  (via drill 0.25)
  Top 0.127: U2.L14 40.72,33.5 v40.34,33.87 | v73.99,22.25 U9.88
  Route2 0.127: v40.34,33.87 40.34,33.93 40.56,34.16 45.19,34.16 45.24,34.11 45.24,28.5 v44.55,27.81
  Route3 0.127: v44.55,27.81 44.55,26.01 46.63,23.93 56.13,23.93 57.25,22.81 66.75,22.81 67.33,22.23 73.97,22.23 v73.99,22.25
ADDR14  (via drill 0.25)
  Top 0.127: U2.D14 40.7,39.08 v40.34,39.47
  Top 0.152: v74.5,23.5 74.5,24.39 U9.89
  Route2 0.127: v74.47,38 74.47,24.41
  Route2 0.152: 74.47,24.41 74.47,23.52 v74.5,23.5
  Route3 0.127: v40.34,39.47 41.12,40.28 45.85,40.28 46.38,39.75 48.01,39.75 48.44,40.18 49,40.18 49.73,39.45 49.73,39.42 50.52,38.63 57.99,38.63 58.19,38.84 61.06,38.84 61.34,39.12 62,39.12 62.46,38.66 74.07,38.66 v74.47,38
ADDR15  (via drill 0.25, 0.38)
  Top 0.127: U2.C14 40.75,39.88 41.12,40.28 47.12,40.28 v47.19,40.21
  Top 0.152: v74.98,25.6 U9.90
  Route2 0.127: v47.19,40.21 47.27,40.13 47.27,39.04 47.24,39.01 47.24,28.4 47.17,28.32 47.17,26.57 v47.14,26.54
  Route2 0.152: v75.01,28.12 75.01,25.63 v74.98,25.6
  Route3 0.127: v47.14,26.54 47.37,26.54 47.5,26.42 57.89,26.42 59.72,28.24 74.88,28.24 v75.01,28.12
AUDIO_LEFT
  Top 0.406: R38.1 122.95,12.65 C79.1 | 124.46,11.2 125.72,12.46 J2.R
  Top 0.813: C79.1 124.6,12.69 124.64,12.73 126.37,12.73 J2.R
  pour Top (no thermals): 124.28,14.71 128.75,14.71 129.03,14.43 129.03,10.9 128.63,10.49 124.38,10.49 123.88,11 123.88,14.27
AUDIO_RIGHT
  Top 0.406: R37.1 129.55,4.9 C78.1
  Top 0.813: C78.1 J2.L
  pour Top (no thermals): 131.78,7.26 136.25,7.26 136.53,6.99 136.53,3.45 136.12,3.05 131.88,3.05 131.37,3.56 131.37,6.83
BL_A  (via drill 0.25)
  Top 0.152: 54.2,58.61 R52.1
  Top 0.203: R53.1 R54.1 | 54.27,58.67 R52.1
  Top 0.305: v52.76,57.63 54,57.63 54.2,57.84 54.2,58.61 | R54.1 54.27,58.67
  Bottom 0.152: J3.17 53.03,56.12 52.58,56.57 52.58,57.45 v52.76,57.63
CBSEL  (via drill 0.25)
  Top 0.127: U2.P13 40.32,30.67 40.32,28.14 40.34,27.94 v40.44,27.84 | v75.46,20.83 75.48,20.85 U9.91
  Route3 0.127: v40.44,27.84 41.35,26.82 41.35,25.43 45.39,21.39 54.81,21.39 55.91,20.29 64.95,20.29 65.81,19.84 69.04,19.84 69.98,20.42 75.31,20.42 75.46,20.57 v75.46,20.83
CDONE  (via drill 0.25)
  Top 0.127: U2.M10 37.51,32.68 v37.12,32.28 | v65.02,18.29 75.62,18.29 v75.67,18.24 | v75.97,22.48 75.97,22.96 75.92,23.04 75.92,23.72 76,23.88 U9.92
  Route2 0.127: v37.12,32.28 37.06,32.23 37.06,30.94 37.44,30.56 37.44,28.93 38.28,28.09 38.28,27.28 39.34,26.21 41.88,26.21 43.03,25.07 47.47,25.07 48.46,24.08 55.8,24.08 57.05,22.83 64.49,22.83 64.8,22.53 64.8,18.52 v65.02,18.29 | v75.67,18.24 75.67,19.74 76.02,20.09 76.02,22.43 v75.97,22.48
CRESET_B  (via drill 0.25)
  Top 0.127: U2.N11 v37.92,32.28 | v37.92,32.28 | v65.86,18.92 76.28,18.92 v76.48,18.72 | v76.48,23.32 U9.93
  Route2 0.127: v37.92,32.28 37.54,31.9 37.54,31.29 37.85,30.99 37.85,29.13 38.63,28.35 38.63,27.56 39.6,26.59 42.29,26.59 43.31,25.58 47.78,25.58 48.51,24.84 55.88,24.84 57.33,23.39 65.15,23.39 65.58,22.96 65.58,19.2 v65.86,18.92 | v76.48,18.72 v76.48,23.32
CSB  (via drill 0.25)
  Top 0.152: U2.B5 v33.92,41.08
  Route2 0.203: v33.92,41.08 34.7,41.86 34.7,53.59 38.68,57.58 46.15,57.58 v46.51,57.94
  Bottom 0.203: v46.51,57.94 46.51,55.61 J3.4
DATA0  (via drill 0.25)
  Top 0.127: U2.D16 42.32,39.1 42.72,39.5 46.66,39.5 46.81,39.34 48.69,39.34 v48.82,39.47 | v72.49,25.96 72.49,24.42 U9.85
  Route2 0.127: v48.82,39.47 48.82,26.01 v48.87,25.88
  Route3 0.127: v48.87,25.88 49.02,25.86 63.27,25.86 63.45,25.68 64.06,25.68 64.24,25.86 71.07,25.86 71.22,26.01 72.42,26.01 v72.49,25.96
DATA1  (via drill 0.25)
  Top 0.127: U2.D15 41.54,39.08 41.94,38.68 42.75,38.68 43.08,39.01 46.66,39.01 v46.79,38.89 | v73.08,25.55 73.08,25.45 73,25.37 73,24.42 U9.86
  Route2 0.127: v46.79,38.89 46.79,27.13 v46.35,26.7
  Route3 0.127: v46.35,26.7 46.35,26.29 47.19,25.3 59.59,25.3 60.25,24.79 72.31,24.79 v73.08,25.55
DATA2  (via drill 0.25)
  Top 0.127: U2.B16 47.62,40.69 v47.68,40.64 | v82.68,28.58 82.78,28.52 84.18,28.52 85.22,28.78 U9.114
  Route2 0.127: v47.68,40.64 47.7,40.67 v47.7,27.48
  Route3 0.127: v47.7,27.48 48.41,26.77 57.66,26.77 59.51,28.63 82.53,28.63 v82.68,28.58
DATA3  (via drill 0.25)
  Top 0.127: U2.B15 41.94,41.08 48.21,41.08 v48.31,41.02 | v83.44,29.03 83.68,29.28 U9.115
  Route2 0.127: v48.31,41.02 48.28,41 v48.28,27.84
  Route3 0.127: v48.28,27.84 49,27.13 57.4,27.13 59.31,29.03 v83.44,29.03
DATA4  (via drill 0.25)
  Top 0.127: U2.A16 v55.78,41.48 | U9.58 55.78,33.27 v55.78,33.29
  Route2 0.127: v55.78,41.48 v55.79,41.48 v55.78,33.29
DATA5  (via drill 0.25)
  Top 0.127: U9.59 57.78,32.78 v57.72,32.72 | v57.77,42.21 41.71,42.21 41.52,42.02 U2.A15
  Route2 0.127: v57.72,32.72 57.72,42.16 v57.77,42.21
DATA6  (via drill 0.25)
  Top 0.127: U9.60 58.39,32.28 v58.36,32.25 | v58.37,38.27 42.34,38.27 U2.E16
  Route2 0.127: v58.36,32.25 58.36,38.25 v58.37,38.27
DATA7  (via drill 0.25)
  Top 0.127: U9.63 59.02,30.78 v59,30.76 | v59,37.77 42.85,37.77 42.75,37.88 41.96,37.88 U2.F15
  Route2 0.127: v59,30.76 v59,37.77
DATA8  (via drill 0.25)
  Top 0.127: U9.64 v59.72,30.28 | v59.67,36.83 53.21,36.83 52.63,37.47 42.34,37.47 U2.F16
  Route2 0.127: v59.72,30.28 59.72,36.83 v59.67,36.83
DATA9  (via drill 0.25)
  Top 0.127: U9.65 60.37,29.78 v60.35,29.79 | v60.38,36.27 55.93,36.27 55.73,36.42 52.96,36.42 52.32,37.08 41.9,37.08 U2.G15
  Route2 0.127: v60.35,29.79 60.35,36.2 v60.38,36.27
DATA10  (via drill 0.25)
  Top 0.127: U9.66 52.59,29.28 v52.58,29.26 | v52.58,36.12 52.58,36.14 52.05,36.68 U2.G16
  Route2 0.127: v52.58,29.26 v52.58,36.12
DATA11  (via drill 0.25)
  Top 0.127: U9.67 57.94,28.78 56.84,27.69 52.07,27.69 v52.05,27.66 | v52.05,35.48 41.9,35.48 U2.J15
  Route2 0.127: v52.05,27.66 v52.05,35.48
DATA12  (via drill 0.25)
  Top 0.127: U2.J16 51.56,35.08 52.32,34.32 54.97,34.32 55.25,34.04 55.25,33.15 55.6,32.79 v55.65,32.54 | v65.76,31.14 65.76,28.42 65.61,28.27 U9.68
  Route3 0.127: v55.65,32.54 55.68,32.26 56.13,31.72 63.5,31.72 63.55,31.78 64.16,31.78 64.21,31.72 65.18,31.72 v65.76,31.14
DATA13  (via drill 0.25)
  Top 0.127: U2.K15 v41.91,34.67 | v41.91,34.67 | v68.48,20.98 68.48,24.33 U9.77
  Route2 0.127: v44.65,33.27 44.65,33.25 44.68,28.78 44.25,28.35 43.23,28.35 43.16,28.27 v43.16,27.15
  Route3 0.127: v43.16,27.15 43.16,25.98 46.28,22.86 55.63,22.86 56.79,21.82 66.06,21.82 67.11,21.23 67.87,20.98 v68.48,20.98
  Bottom 0.127: v41.91,34.67 42.34,35.13 44.45,35.13 44.7,34.87 v44.65,33.27
DATA14  (via drill 0.25)
  Top 0.127: U2.K16 42.32,34.3 42.7,34.67 45.7,34.67 v45.74,34.62 | v69.01,22.96 69.01,24.37 U9.78
  Route2 0.127: v45.74,34.62 45.74,28.17 v45.34,27.76
  Route3 0.127: v45.34,27.76 45.34,27.69 45.11,27.46 45.11,26.11 46.81,24.41 56.52,24.41 57.56,23.37 66.95,23.37 67.49,22.83 68.89,22.83 v69.01,22.96
DATA15  (via drill 0.25)
  Top 0.127: v57.78,29.79 57.76,29.82 52.3,29.82 51.79,29.31 42.72,29.31 42.57,29.34 42.47,29.44 U2.T16 | v69.49,23.5 69.49,24.39 U9.79
  Route2 0.127: v57.78,29.79 57.78,25.02 v58.04,24.77
  Route3 0.127: v58.04,24.77 59.64,24.77 60.07,24.33 69.39,24.33 69.49,24.23 v69.49,23.5
DB0  (via drill 0.25)
  Top 0.203: U2.A6 34.44,41.6 34.44,52.17 39.6,57.33 48.74,57.33 v49.02,57.61
  Bottom 0.203: v49.02,57.61 J3.9
DB1  (via drill 0.25)
  Top 0.203: U2.A7 35.13,41.49 35.13,51.46 36.37,52.71 49.22,52.71 49.43,52.91 v49.43,54
  Bottom 0.203: v49.43,54 49.48,54 49.53,54.05 49.53,55.7 49.5,55.73 49.5,55.61 J3.10
DB2  (via drill 0.25)
  Top 0.203: U2.A9 36.73,41.49 36.73,50.47 37.62,51.41 38.28,52.07 v38.33,52.07 | v49.61,52.04 49.99,52.43 49.99,54.58 50.04,54.64 v50.04,54.69
  Route2 0.203: v38.33,52.07 38.35,52.04 v49.61,52.04
  Bottom 0.203: v50.04,54.69 50.03,54.67 J3.11
DB3  (via drill 0.25)
  Top 0.203: U2.A10 37.54,41.5 37.54,49.61 38.1,50.11 v38.53,50.52 | v50.14,50.98 50.5,51.33 v50.5,54.2
  Route2 0.203: v38.53,50.52 38.99,50.98 v50.14,50.98
  Bottom 0.203: v50.5,54.2 50.53,54.23 J3.12
DB4  (via drill 0.25)
  Top 0.203: U2.A11 38.33,41.49 38.33,42.98 38.08,43.23 38.08,49.38 38.53,49.83 v39.98,49.83 | v50.98,49.83 51.03,49.99 v51.03,54.74
  Route2 0.203: v39.98,49.83 v50.98,49.83
  Bottom 0.203: v51.03,54.74 J3.13
DB5  (via drill 0.25)
  Top 0.127: U2.B6 v34.71,41.07
  Route2 0.203: v34.71,41.07 35.26,41.61 35.26,53.29 38.73,56.77 51.41,56.77 v51.44,56.74
  Bottom 0.203: v51.44,56.74 51.44,56.69 51.51,56.59 51.51,55.6 J3.14
DB6  (via drill 0.25)
  Top 0.127: U2.B7 v35.51,41.07 | v35.51,41.07
  Route2 0.203: v35.51,41.07 35.76,41.33 35.76,51.87 37.21,53.31 51.79,53.31 v51.89,53.42
  Bottom 0.203: v51.89,53.42 51.97,53.42 52.02,53.47 J3.15
DB7  (via drill 0.25)
  Top 0.127: U2.B8 v36.32,40.28
  Top 0.203: v52.55,52.86 v52.55,54.79
  Route2 0.203: v36.32,40.28 36.63,40.72 36.63,41.48 36.65,41.5 36.65,41.58 36.73,41.66 36.73,51.69 37.82,52.78 52.43,52.78 v52.55,52.86
  Bottom 0.203: v52.55,54.79 52.53,54.86 J3.16
ETH_RMII_REF_CLK
  Top 0.254: U18.14 77.48,56.51 R76.2 | U9.35 66.98,46.63 66.98,46.66 66.5,46.94 65.41,46.94 65.23,47.12 65.23,49.83 arc-90 65.45,50.05 66.59,50.05 arc90 66.81,50.28 66.81,50.32 arc90 66.59,50.54 65.45,50.54 arc-90 65.23,50.76 65.23,50.81 arc-90 65.45,51.03 66.59,51.03 arc90 66.81,51.25 66.81,51.3 arc90 66.59,51.52 65.45,51.52 arc-90 65.23,51.74 65.23,52.4 65.56,52.86 73.13,52.86 76.53,56.26 77.23,56.26 R76.2 | 77.24,56.31 77.28,56.31 R76.2
ETH_RX+  (via drill 0.25)
  Top 0.152: 108.86,65.25 108.97,65.15 | 108.97,64.09 109.07,63.98
  Top 0.203: U18.23 83.42,61.96 R23.2 84.4,62.92 85.19,63.7 103.86,63.7 105.41,65.25 108.86,65.25 | 108.97,65.15 108.97,64.09
  Top 0.254: v110.24,64.01 109.07,63.98 Z2.3
  Route2 0.254: J1.4 115.57,61.11 v110.24,64.01
ETH_RX-  (via drill 0.25)
  Top 0.152: R4.2 84.53,61.34
  Top 0.203: U18.22 84.27,61.46 | 84.53,61.34 85.29,62.1 104.7,62.1 105.51,62.92 108.1,62.92 Z2.2
  Top 0.254: 84.27,61.46 R4.2 | Z2.2 v109.98,61.72
  Route2 0.203: 122.71,58.6 J1.6
  Route2 0.254: 122.71,58.6 117.45,58.6 v109.98,61.72
ETH_TX+
  Top 0.152: R1.2 84.49,59.7 | 108.74,59.06 Z1.3
  Top 0.203: U18.21 82.95,60.96 84.15,59.77 | 84.49,59.7 85.24,58.95 104.93,58.95 105.99,60.02 108.61,60.02 108.74,59.89 108.74,59.06
  Top 0.254: 84.15,59.77 84.47,59.77 R1.2 | Z1.3 118.11,62.59 J1.1
ETH_TX-
  Top 0.152: R3.2 84.52,57.67 | 108.84,57 108.84,56.72 Z1.2
  Top 0.203: U18.20 82.19,60.46 R3.2 | 84.52,57.67 85.39,56.79 103.33,56.79 104.34,57.81 108.03,57.81 108.84,57
  Top 0.254: Z1.2 109.88,56.69 111.99,58.8 J1.3
EXP_PIN12_VOLT  (via drill 0.25, 0.38)
  Top 1.016: JP2.12 v6.29,17.07 | v6.27,51.36 6.27,68.43 v6.3,68.43 JP5.12 | v6.27,51.36 6.07,51.36 v6.07,34.21 | v6.07,34.21 6.07,17.09 | v6.27,51.36 JP6.12 | JP7.12 v6.07,34.21
  Top 1.676: v76.06,6.65 76.07,7.8 | 76.07,7.8 R8.2 | 76.07,7.8 76.06,7.8 v76.06,7.42 | v76.06,8.26 76.06,8.88 76.15,8.97 R35.2
  Route2 1.016: v6.3,68.43 6.29,68.43 6.29,68.48 | v6.27,51.36 6.1,51.36 | v6.07,34.21 6.07,34.19 6.29,34.19 v6.29,17.07 5.99,17.07 5.99,17.09
  Route2 1.676: 6.29,68.54 6.29,68.48 v6.29,17.07 6.29,3.07 7.58,1.78 74.37,1.73 76.09,3.44 v76.06,6.65 v76.06,8.26
F_LRCLK  (via drill 0.25)
  Top 0.127: U2.G14 40.7,36.68 v40.34,36.3 | v66.52,20.9 66.52,24.36 U9.73
  Route3 0.127: v40.34,36.3 39.67,35.66 39.67,32 40.21,31.47 42.42,31.47 42.57,31.32 42.57,25.78 45.95,22.4 55.45,22.4 56.57,21.29 65.79,21.29 v66.52,20.9
F_MCLK  (via drill 0.25)
  Top 0.127: U2.H16 42.56,36.12 v43.38,36.12 | v78,25.73 77.98,25.71 U9.96
  Route2 0.127: v77.93,35.81 78,35.74 v78,25.73
  Route3 0.127: v43.38,36.12 43.41,36.14 51.54,36.14 51.97,36.58 58.39,36.58 59.16,35.81 v77.93,35.81
F_SCLK  (via drill 0.25)
  Top 0.127: U2.H11 v38.71,35.5 | v67.21,20.68 67.21,21.06 66.95,21.31 66.95,24.37 U9.74
  Route3 0.127: v38.71,35.5 39.04,35.48 39.27,35.36 39.27,31.83 39.95,31.17 41.73,31.17 41.94,30.84 41.94,25.6 45.62,21.92 55.04,21.92 56.16,20.8 65.2,20.8 66.17,20.32 66.83,20.32 v67.21,20.68
F_SDIN  (via drill 0.25)
  Top 0.127: U2.E14 v41.12,37.88 | v68,23.37 68,24.39 U9.76
  Route2 0.127: v41.12,37.88 46.1,37.87 46.25,37.72 46.25,27.64 v45.77,27.15
  Route3 0.127: v45.77,27.15 45.77,26.09 46.99,24.87 56.87,24.87 57.61,24.13 57.61,24.1 57.81,23.9 67.87,23.9 68,23.77 v68,23.37
FLASH1_CS  (via drill 0.38)
  Top 0.152: v91.29,30.23 91.29,30.28 92.08,31.06 107.8,31.09 109.32,32.61 109.32,33.3 108.99,33.63 107.97,33.63 107.95,33.6 108.07,33.6 U10.1 | v78.84,26.52 78.84,25.32 78.97,25.2 78.97,24.42 U9.98
  Top 0.203: U10.1 108.06,33.55
  Route2 0.152: v91.29,30.23 91.24,30.28 78.99,30.28 78.99,26.67 v78.84,26.52
FPGA_CFG_CS
  Top 0.127: U2.R12 38.72,29.87 38.72,29.08 38.84,28.96 39.04,28.75 39.04,28.04 40.13,26.95 41.86,26.95 42.09,26.72 42.09,26.24 42.8,25.37 56.57,25.37 58.24,23.85 58.27,23.85 61.92,20.19 78.44,20.19 78.49,20.24 U9.97
FPGA_VCC_1V2  (via drill 0.25)
  Top 0.127: v30.73,33.87 v30.73,33.88 | U2.K6 | 34.32,37.46 U2.F6 | 37.51,37.48 U2.F10 | 37.5,34.28 U2.K10
  Top 0.203: U2.L2 v30.73,33.87 | v33.92,33.88 U2.K6 | v34.71,37.1 34.32,37.46 | v37.12,37.08 37.17,37.14 37.51,37.48 | v37.12,34.68 37.5,34.28 | v40.69,42.16 40.72,42.13 U2.A14 | U2.K10 v37.12,33.88
  Top 0.254: L1.1 45.15,21.93 45.09,22
  Top 0.406: v37.69,23.7 40.23,23.7 41.38,22.58 44.68,22.58 45.09,22.17 45.09,22 45.09,19.89 R50.2
  Route2 0.127: v30.73,33.88 31.22,33.4 | v33.92,33.88 34.42,34.38 | 34.62,37.08 v34.71,37.1 | 37.11,37.16 37.12,37.13 v37.12,37.08 37.11,37.07 37.12,37.06
  Route2 0.203: 31.22,33.4 31.88,33.4 32.77,34.29 33.53,34.29 v33.92,33.88 | 34.42,34.38 34.42,36.88 34.62,37.08 | v34.71,37.1 34.92,37.31 36.96,37.31 37.11,37.16 | 37.12,37.06 v37.12,34.68 | 37.17,37.14 37.42,37.39 | 37.42,37.39 39.83,37.39 40.11,37.67 40.11,38.84 39.78,39.17 39.78,41.5 40.44,42.16 v40.69,42.16 | 37.12,37.13 37.38,37.39 37.42,37.39 | v37.12,33.88 36.83,32.82 36.6,32.44 36.32,30.73 36.93,30.3 36.93,28.22 v37.29,27.86
  Bottom 0.406: v37.29,27.86 37.29,24.26 v37.69,23.7
  pour Top (no thermals): 45.06,20.17 45.31,19.91 45.31,18.75 45.09,18.52 45.09,16.05 44.45,15.42 44.45,13.56 44.3,13.41 43.21,13.41 43,13.61 43,18.64 42.72,18.92 42.72,20.07 42.82,20.17
FSMC_CLK  (via drill 0.25, 0.38)
  Top 0.152: U9.117 87.12,30.28 v87.73,30.91 | v36.32,34.68 | v36.32,34.68 U2.K9
  Bottom 0.152: v87.73,30.91 87.1,30.28 60.94,30.28 59.79,31.22 51.54,31.22 50.06,32.69 43.59,32.69 42.65,33.63 40.89,33.63 40.28,33.02 38.12,33.02 37.97,33.17 37.97,34.82 37.59,35.2 36.83,35.2 v36.32,34.68
FSMC_NE1  (via drill 0.25)
  Top 0.127: U2.J14 40.31,34.67 v40.34,34.7 | v84.38,33.32 84.43,33.28 U9.123
  Route3 0.127: v40.34,34.7 40.92,33.81 55.93,33.81 56.59,33.32 v84.38,33.32
FSMC_NE4  (via drill 0.25)
  Top 0.127: U2.K14 41.11,34.7 v41.12,34.68 | v84.76,35.28 U9.127
  Route3 0.127: v41.12,34.68 41.5,34.14 53.64,34.14 53.64,34.32 54.1,34.77 84.48,34.77 v84.76,35.28
FSMC_NL_NADV  (via drill 0.25)
  Top 0.127: U2.B14 v41.12,41.08 | v41.12,41.08 | v79.53,40.74 79.99,40.28 U9.137
  Route3 0.127: v41.12,41.08 41.5,41.48 54.64,41.48 55.09,41.02 59.59,41.02 60.25,41.68 61.62,41.68 62.1,41.2 75.95,41.2 76.78,42.04 79.43,42.04 79.53,41.94 v79.53,40.74
FSMC_NOE  (via drill 0.25)
  Top 0.127: U2.F14 v41.12,37.08 | v82.47,30.78 82.48,30.78 U9.118
  Route2 0.127: v82.42,37.34 82.47,37.29 v82.47,30.78
  Route3 0.127: v41.12,37.08 41.53,36.68 51.21,36.68 51.64,37.11 52.81,37.11 53.09,36.83 57.66,36.83 58.11,37.29 64.69,37.29 64.75,37.34 v82.42,37.34
FSMC_NWE  (via drill 0.25)
  Top 0.127: U2.H14 41.15,35.46 v41.12,35.48 | v81.43,31.29 81.45,31.28 U9.119
  Route2 0.127: v81.43,35.33 v81.43,31.29
  Route3 0.127: v41.12,35.48 51.28,35.48 51.84,34.93 52.35,34.93 53.67,36.25 55.7,36.25 56.62,35.33 v81.43,35.33
GND  (via drill 0.25, 0.64)
  Top 0.152: U9.16 | 69,45.79 68.98,45.77 | C103.2 106.21,32.13
  Top 0.203: U9.16 v76.48,44.73 | v35.51,36.3 U2.G7 | U2.G8 35.94,36.68 v36.32,36.3 36.34,36.3 U2.G9 | U2.H9 v36.32,35.48 U2.J9 | U2.H8 35.91,35.88 v35.51,35.48 | U2.H7 v35.51,35.48 | U2.J7 35.12,35.1 v35.51,35.48 | U2.J8 35.91,35.08 v35.51,35.48 | U2.K7 v35.51,34.67 | 32.72,41.43 U2.A4 32.24,40.97 v32.32,41.08 | U2.A12 39.12,41.43 v38.73,41.1 | v41.12,38.68 U2.E15 | U2.K2 | U2.K2 v31.52,33.88 | v33.12,29.88 | v33.12,29.88 U2.T4 | v34.72,30.68 U2.R7 | v39.42,29.03 39.12,29.36 U2.T12 | v41.92,33.08 41.76,33.22 U2.L15 | U2.N8 35.91,31.88 v35.53,32.27 | U2.E7 v34.72,37.88 | C21.1 78.44,52.91 v78.46,53.19 | 74.15,50.57 74.19,50.53 | C5.1 v72.67,50.44
  Top 0.254: U9.38 v65.7,43.28 v65.71,43.28 | U9.51 v65.73,36.78 | U9.61 65.28,31.78 v65.71,31.95 | U9.83 71.48,25.44 v71.45,25.48 | U9.94 76.98,25.1 v77.04,25.37 | U9.107 83.48,25.51 v83.46,25.53 | U9.120 v84.71,31.78 | U9.130 86.56,36.78 v87.05,36.55 | U9.138 84.74,40.78 v84.73,40.77 | v68.96,44.55 68.98,44.45 U9.31 68.98,45.77 68.98,45.9 69,45.92 | C100.2 59.77,26.77 | 59.77,26.77 v59.44,27.1 | 59.77,26.77 59.59,26.77 59.39,26.57 59.39,26.59 59.41,26.62 | U7.8 v114.81,11.4 | v115.85,14.22 115.38,14.22 C74.2 115.3,13.74 v115.88,13.74 | 106.21,32.06 106.21,32.13 106.21,37.12 106.48,37.39 U10.4 v109.43,37.39 v109.44,37.4 | v74.78,68.15 74.8,68.17 74.83,68.17 | 76.58,68.41 X1.GND@1 75.87,68.62 | X1.GND@2 80.28,65.71 | C129.1 82.36,68.15 | R26.2 86.07,64.59 | R105.2 86.07,66.19 | R104.2 70.93,58.37 | C65.2 82.08,65.51 | C63.2 81.79,57.21 | C40.2 69.61,48.12 v69.6,48.13 | C99.2 66.91,48.12 v66.93,48.13 | v78.28,61.85 U18.GP
  Top 0.305: U11.8 28.22,5.56 v27.89,5.92
  Top 0.406: C87.2 v63.02,44.4 | C98.2 v61.21,36.35 | C101.2 61.27,31.27 v61.24,31.24 | C90.2 60.73,25.35 v60.71,25.32 | C88.2 v72.01,20.9 | v77.5,20.93 77.5,21.37 C89.2 | 82.91,20.45 82.91,20.27 v83.13,20.04 | C102.2 82.91,20.45 | 82.91,20.45 82.53,20.07 82.5,20.07 82.47,20.09 82.55,20.09 82.58,20.07 | C85.2 v84.15,21.31 | C94.2 v89.36,32.31 | C91.2 v88.98,37.24 | C96.2 89.28,43.23 v89.31,43.26 | C92.2 89.15,44.04 89.18,44.07 v89.33,44.07 | v92.38,17.4 91.85,16.87 U12.GPAD | C86.2 v78.41,46.99 | X2.GND@2 74.19,50.53 74.71,50.53 75.21,51.03 v75.21,51.46 | v78.74,48.31 77.66,48.31 X2.GND@1 | Z3.1 112.97,47.52 112.97,47.89 | 112.97,47.89 v112.97,48.43 | 112.97,47.89 113.54,47.89 113.54,48.46 | U8.3 127.36,30.78 v127.37,30.77 | U8.13 v123.97,28.06 v123.97,28.05 | C64.2 v90.55,58.06 90.35,58.04 | 72.21,64.54 v72.19,64.85 | C67.2 72.21,64.54 | 72.21,64.54 72.24,64.31 | C66.2 72.49,63.3 v72.21,63.58 | v72.21,63.07 72.21,63.17 | C128.1 v74.78,68.15 | 76.58,68.41 v76.58,69.11 | 75.87,68.62 75.87,69.09 | X1.GND@2 80.42,66.34 v81.03,66.57 | 82.36,68.15 v82.83,68.15 | 86.07,64.59 v86.79,64.59 | 86.07,66.19 v86.82,66.19 | 70.93,58.37 v70.16,58.37 | 82.08,65.51 v82.07,66.01 | 81.79,57.21 v81.79,56.41 | R36.2 v40.87,44.93 | C3.2 27.05,5.35 v27.05,6.12 | C4.2 25.96,5.66 v26.19,6.07 | U11.7 29.92,6.81 v29.9,6.83 | U11.6 v32.26,5.11 | v29.87,3.35 29.92,3.4 U11.5 30.6,4.58 U11.2 | C12.2 41.1,53.92 v41.07,53.95 | C14.2 41.1,55.4 v41.07,55.37
  Top 0.61: C73.1 111.98,8.81 v110.06,8.79 | C72.2 v105.31,7.26 | C71.2 v105.79,8.89 | v106.07,16.41 106.02,16.46 106.02,16.48 | C76.2 110.67,17.28 v110.67,18.52 | 96.71,21.62 v97.16,22.06 | C109.2 96.71,21.62 | 96.71,21.62 97.18,21.15 | C110.2 88.99,22.96 v88.98,22.97 | R25.2 113.03,54.94 v112.97,54.88 | R24.2 113.03,68.43 v112.97,68.49 | v106.31,61.63 106.43,61.75 Z2.1 107.24,60.78 107.26,60.76 | v106.24,56.6 106.32,56.69 Z1.1 107.14,55.65 | R5.2 120.65,6.77 v120.65,5.99 | R2.2 120.85,14.39 v120.85,14.43 | C1.2 v118.44,30.63 | C2.2 126.97,24.23 v127,24.21 | Z4.1 132.56,32.89 132.84,32.94 v132.89,33.02 | J5.6 v122.33,43.97
  Top 0.813: C111.C 84.55,18.42 | 84.55,18.42 84.55,17.37 v84.56,17.4 | 84.55,18.42 83.83,18.42 83.29,18.16 | C111.C 83.34,19.28 83.16,19.1 | C111.C 84.4,19.28 83.19,20.5 | C111.C 84.55,21.16 84.43,21.29 | C107.2 v94.55,10.35 v94.54,10.34 | C107.2 94.74,11.73 94.89,11.58 | 94.89,11.58 95.73,10.74 | 94.89,11.58 95.22,11.58 95.78,12.14 | C107.2 94.88,12.91 94.89,13.16 | 90.12,7.77 C106.C 90.93,8.58 91.11,8.41 | 90.12,7.77 90.09,7.7 v89.61,7.09 | 90.12,7.77 v90.83,7.06 90.88,7.16 | 91.11,8.41 91.97,7.54 | 91.11,8.41 91.85,8.41 92.08,8.64 | C78.2 128.59,3.32 v128.5,3.23 | C79.2 v122.99,15.47
  Top 1.016: CON1.6 137.52,28.58 v137.54,28.6 | CON1.8 132.07,28.48 v131.95,28.6 | CON1.7 137.52,16.53 v137.54,16.56 | CON1.9 132.07,16.58 v132,16.51 | CON1.8 132.07,27.31 v130.84,28.55 | CON1.8 132.07,27.6 v133.07,28.6 | CON1.6 137.52,27.5 v136.47,28.55 | CON1.6 137.52,27.47 v138.61,28.55 | CON1.7 137.52,17.56 v136.42,16.46 | CON1.7 137.52,17.64 v138.66,16.51 | CON1.9 132.07,17.6 v130.94,16.46 | CON1.9 132.07,17.56 v133.12,16.51 | v136.83,13 136.29,12.46 J2.G 135.12,12.93 | 135.12,12.93 135.12,12.98 | 135.12,12.98 v136.42,14.27 | 135.12,12.98 135.12,14.4 v135.1,14.43 | 135.12,12.93 135.03,13.03 | 135.03,13.03 v133.83,14.22 | 135.03,13.03 133.45,13.03 v133.38,12.95
  Bottom 0.203: 35.51,32.26 v35.53,32.27 35.51,32.26 C9.2 | 33.12,35.48 33.12,32.66 33.98,31.83 34.88,31.83 | J3.18 v53.52,56.77 | J3.19 54.08,56.74 | J3.20 54.56,56.77
  other vias: 129.87,27.58 129.87,26.52 129.87,24.49 120.7,18.87 121.72,18.77 122.81,18.77 122.83,17.48 102.31,16.56 103.5,18.24 104.88,18.26 106.48,18.54 102.39,18.59 106.65,20.19 102.39,19.91 101.07,19.96 101.09,18.59 92.41,16.28 91.26,16.28 91.26,17.42 83.34,18.19 83.13,19.15 95.68,10.82 95.78,12.17 94.89,13.13 92.1,8.61 91.97,7.57 82.55,20.04 59.41,26.59 97.14,21.16 36.63,21.23 36.6,20.62 36.6,20.02 36.6,19.38 36.6,17.81 36.6,17.27 36.6,16.71 36.6,16.15 46.48,15.42 46.86,14.68 46.86,13.97 47.4,15.21 47.55,14.33 48.06,16.28 48.01,17.17 48.01,18.14 47.78,19.08 47.37,19.68 113.53,48.45 125.43,30.02 124.41,30 124.41,30.96 125.4,31.01 77.52,61.87 79.1,61.85 79.15,60.43 78.31,60.4 77.47,60.43 77.47,61.19 79.07,61.16 72.21,64.34 75.9,69.09 107.1,55.69 107.25,60.74 54.05,56.77 54.58,56.77
  pour Top (no thermals): 129.44,27.97 132.99,27.97 133.3,27.66 133.3,24.26 133.1,24.05 129.54,24.05 129.18,24.41 129.18,27.71
  pour Bottom (isolate 0.254): 6.88,72.59 139.32,72.59 139.32,0.25 6.88,0.25
  pour Top (no thermals): 120.22,20.8 120.22,20.24 119.25,19.28 119.25,16.18 119.81,15.62 124.18,15.62 124.94,16.38 124.94,17.14 124.03,18.06 124.03,20.55 123.52,21.11 120.52,21.11
  pour Top (no thermals): 100.61,20.95 107.26,20.95 108.89,19.33 108.89,16.94 107.37,15.42 100.86,15.42 100.15,16.28 100.15,20.5